# EAGLE board A20-Watermelon_Rev_A (EAGLE 4.16), part 1 of 6
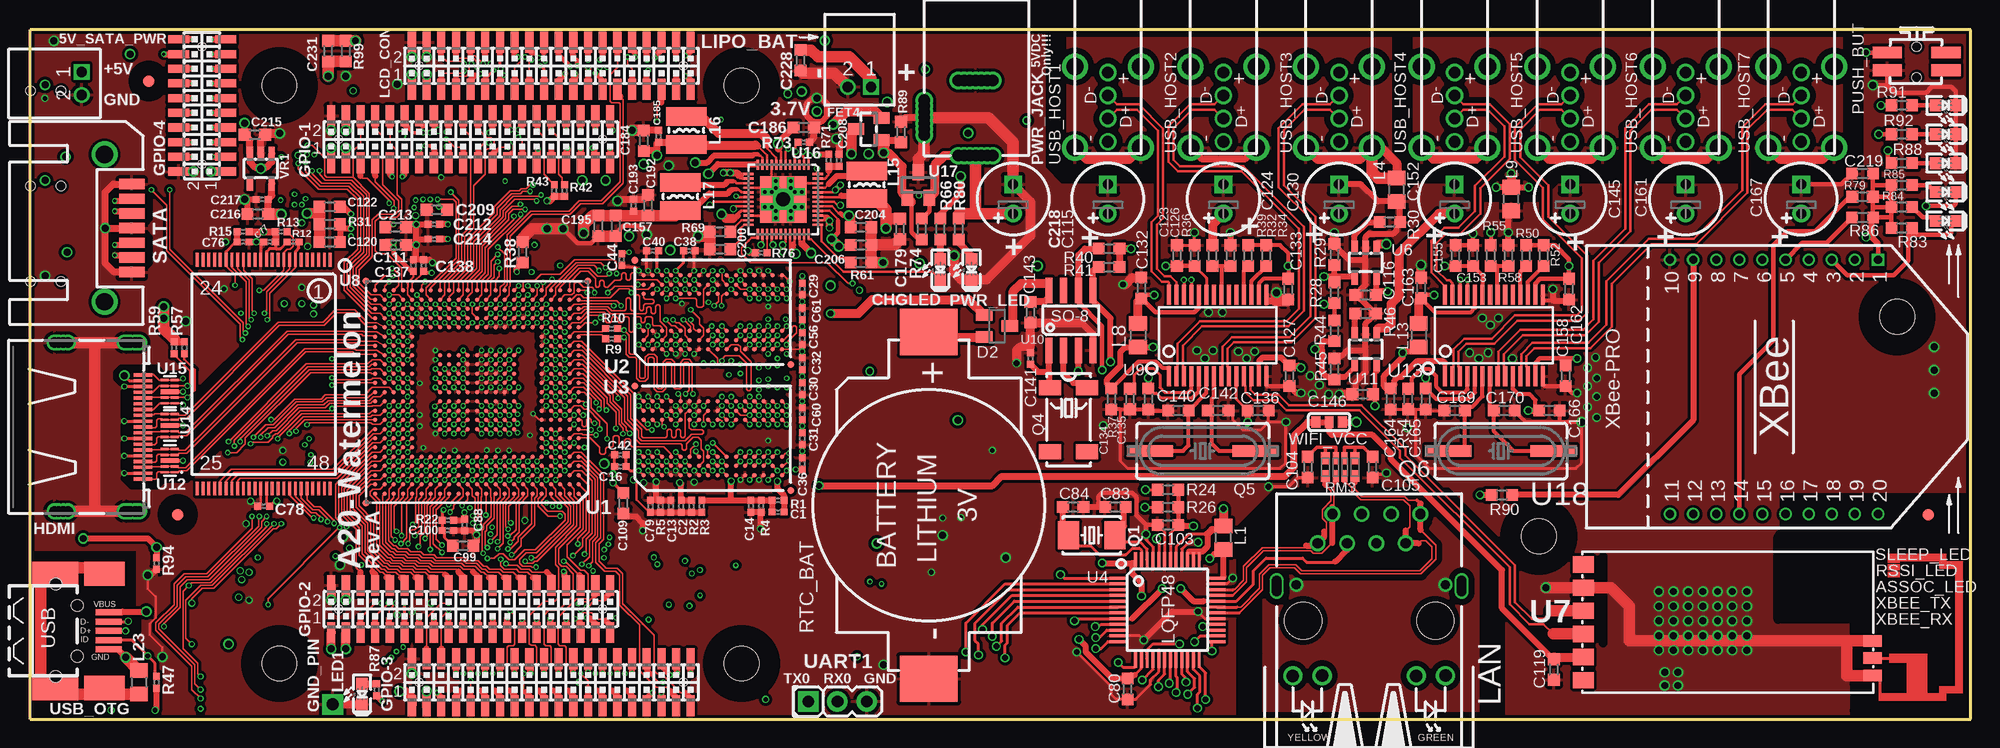
[diagram p5: board, top side]
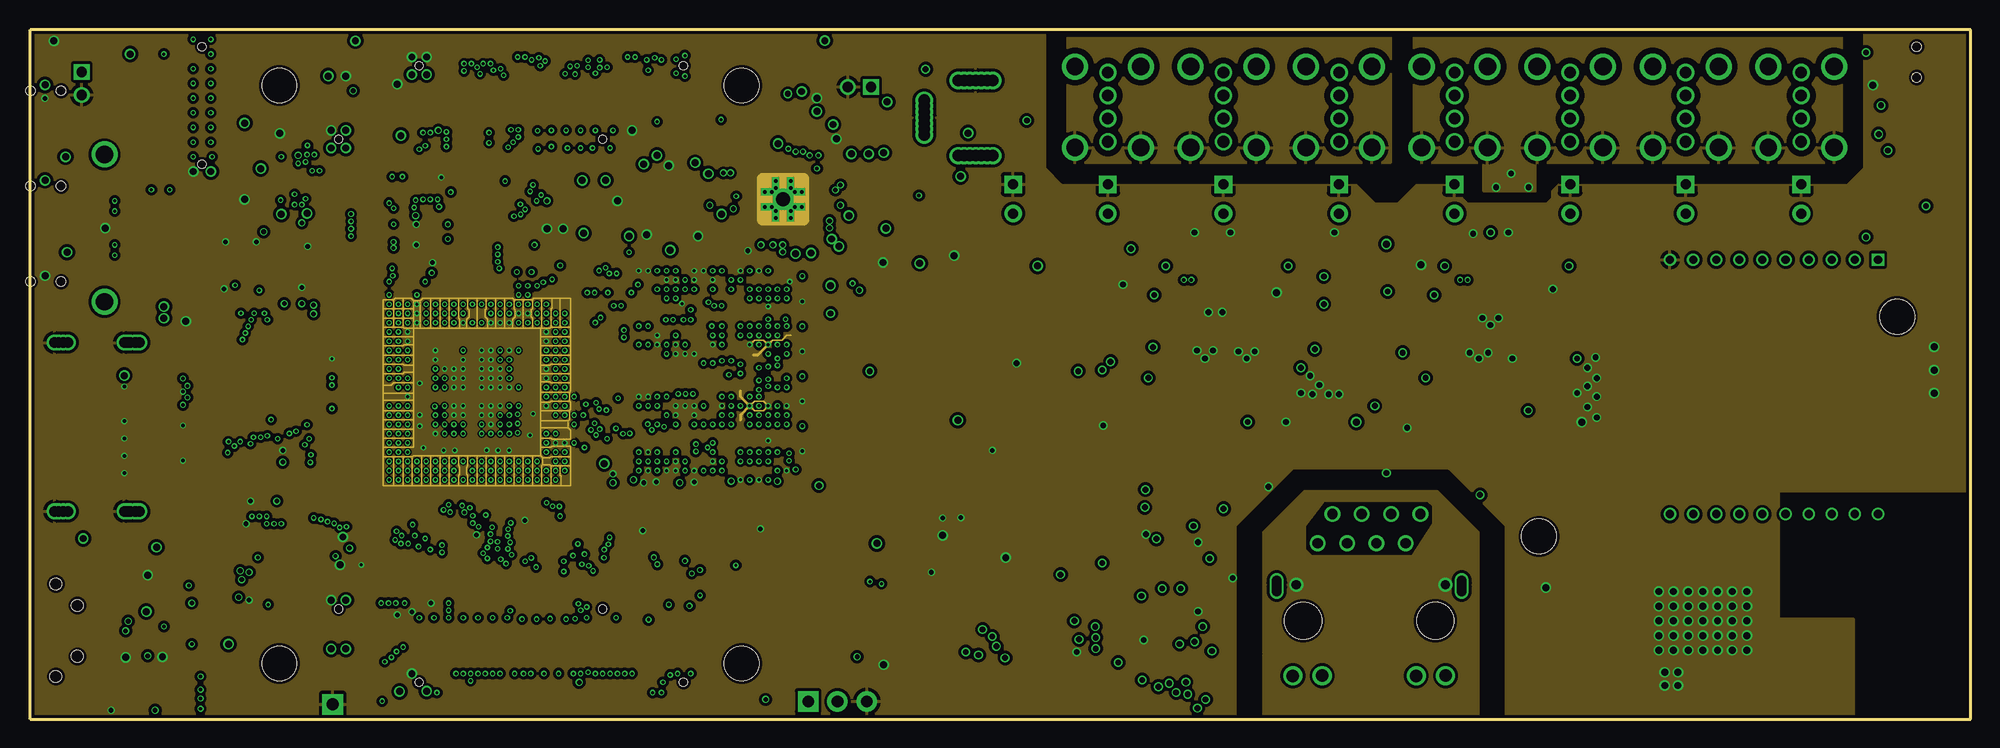
[diagram p6: board, inner layer GND]
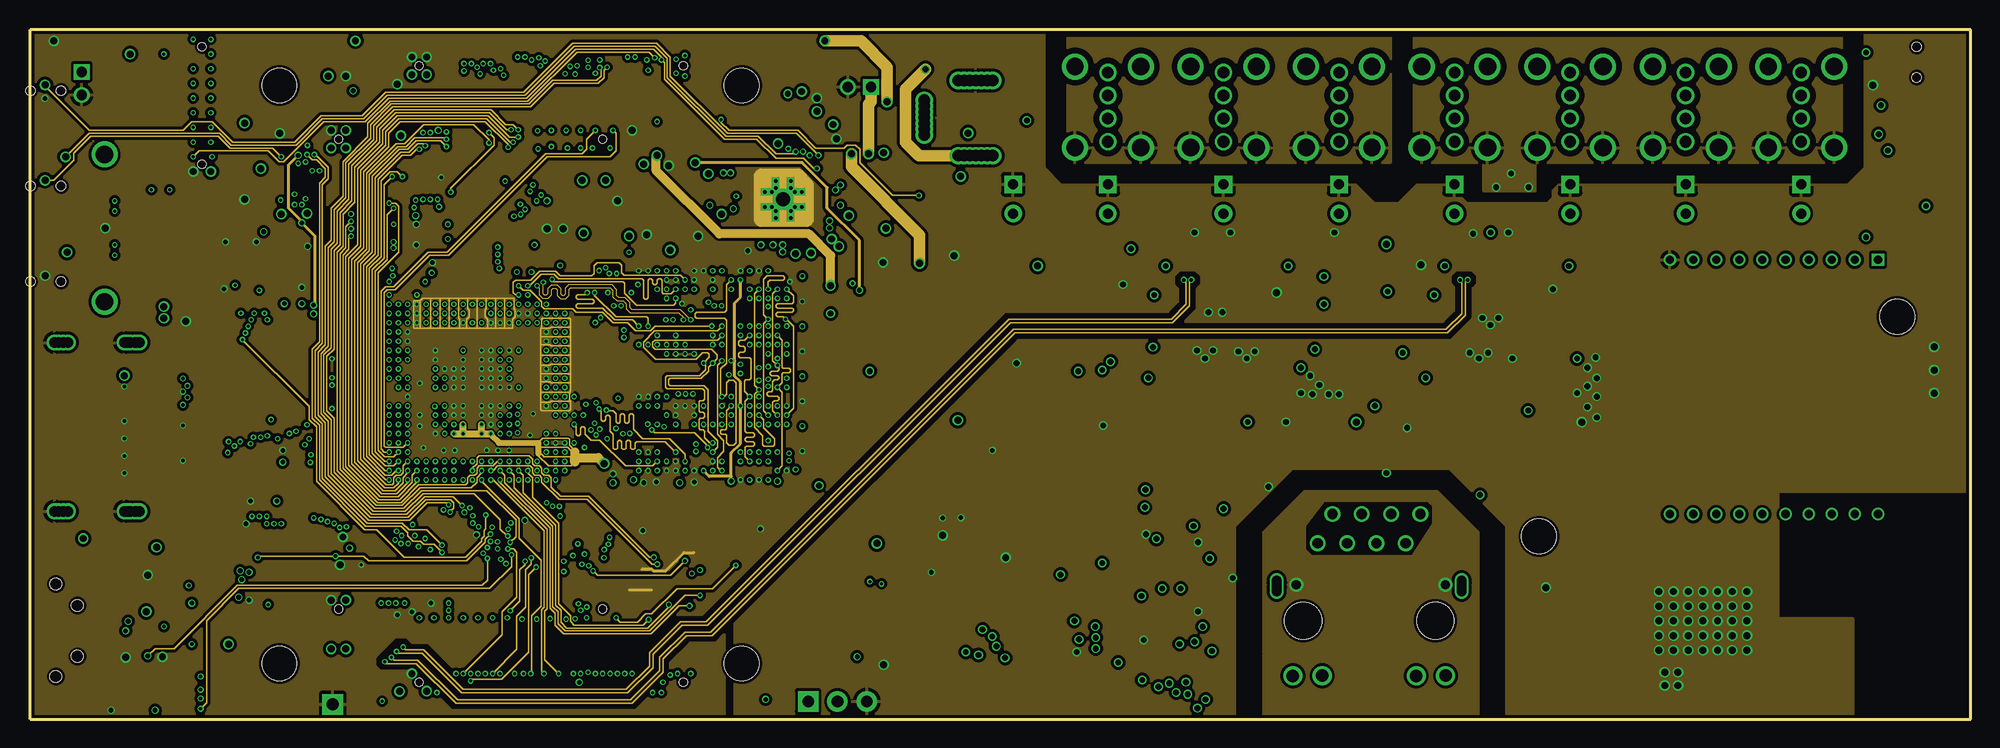
[diagram p7: board, inner layer Route3]
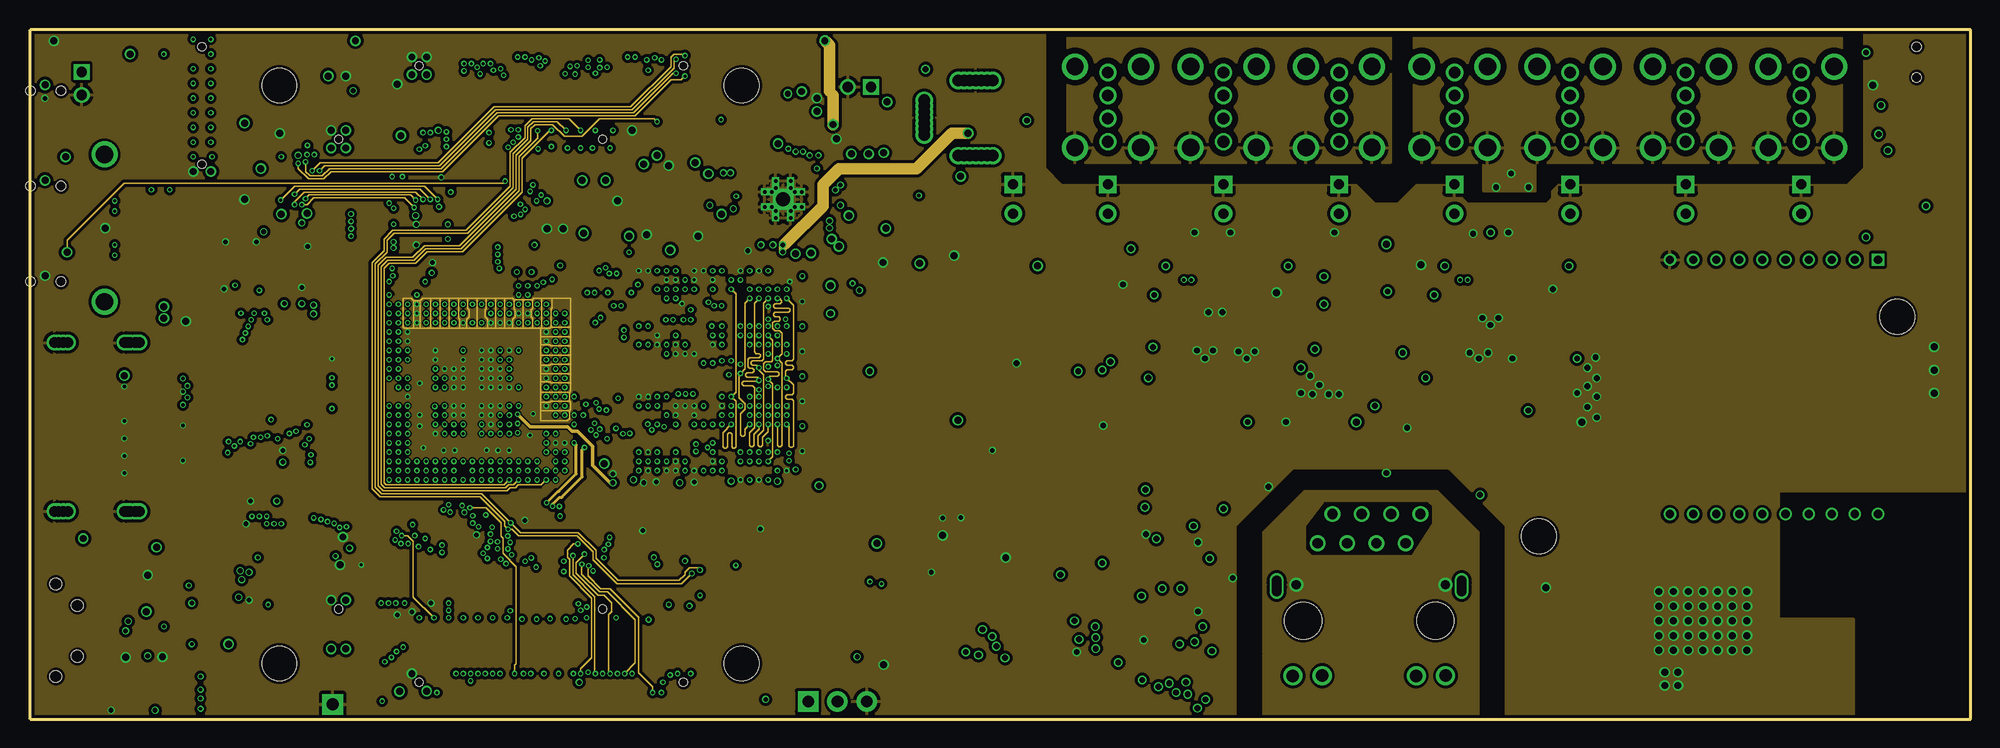
[diagram p8: board, inner layer Route4]
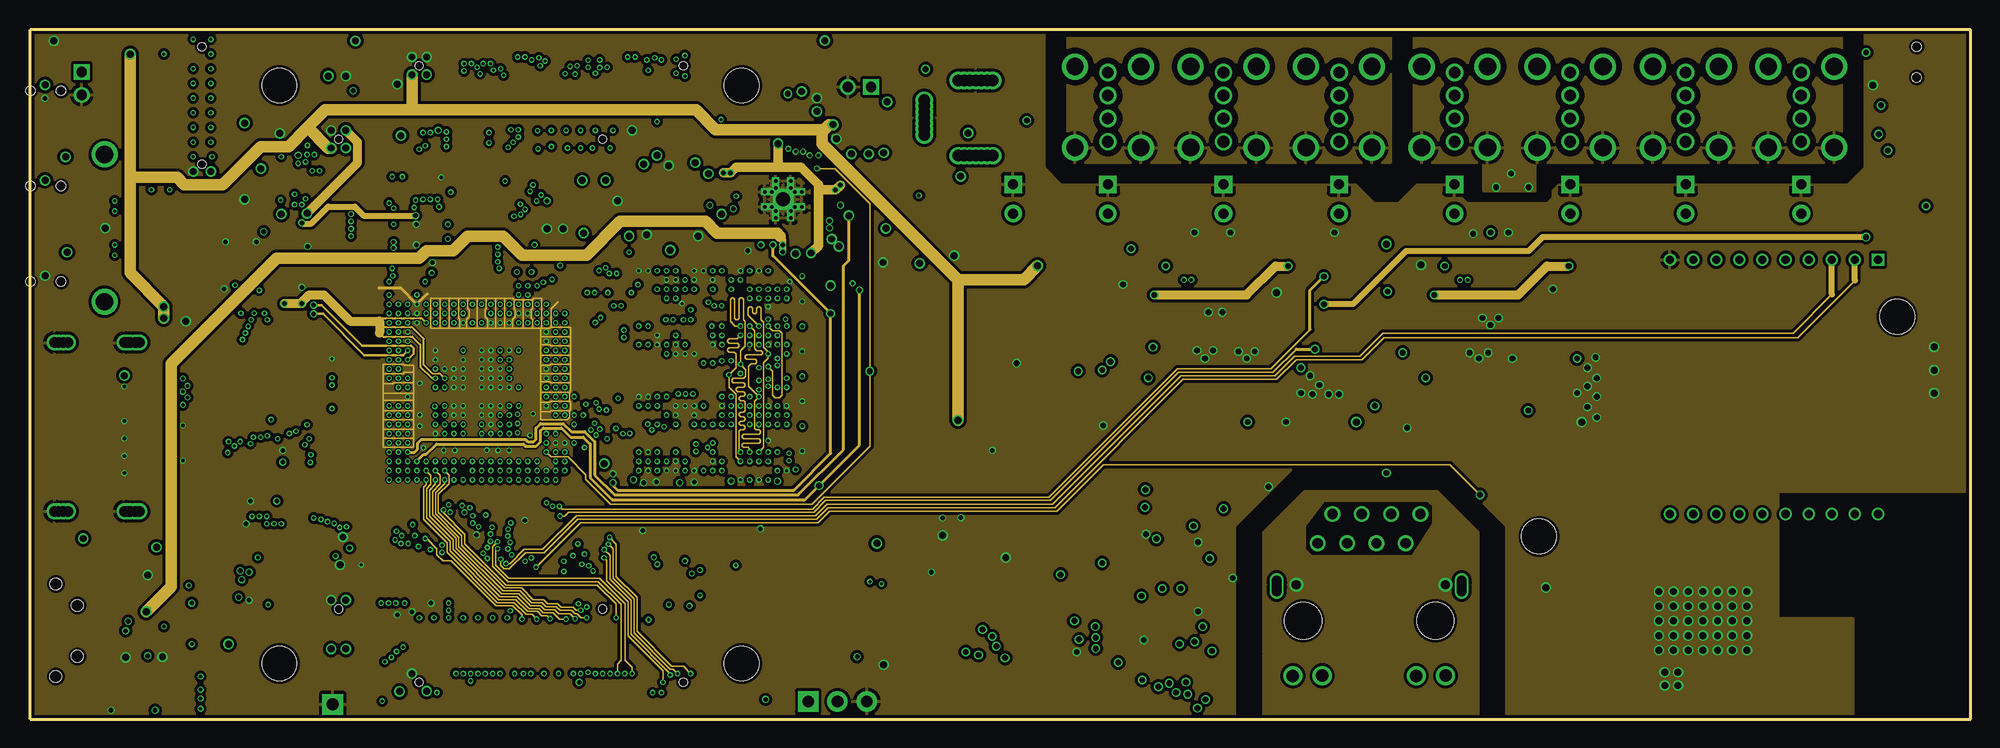
[diagram p9: board, inner layer Route13]
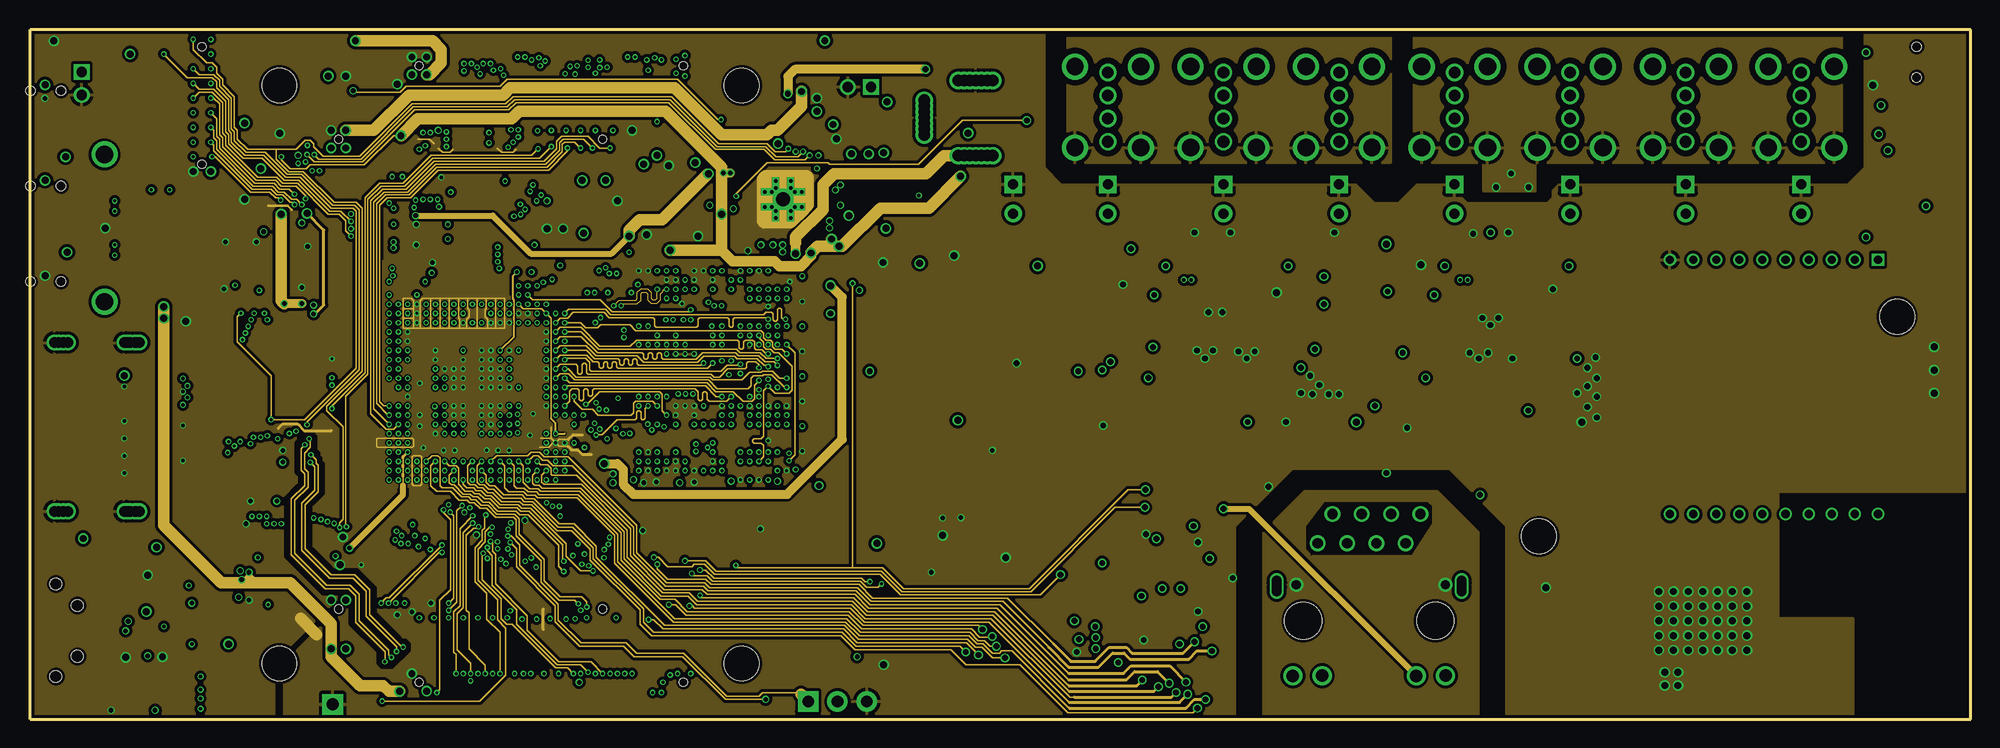
[diagram p10: board, inner layer Route14]
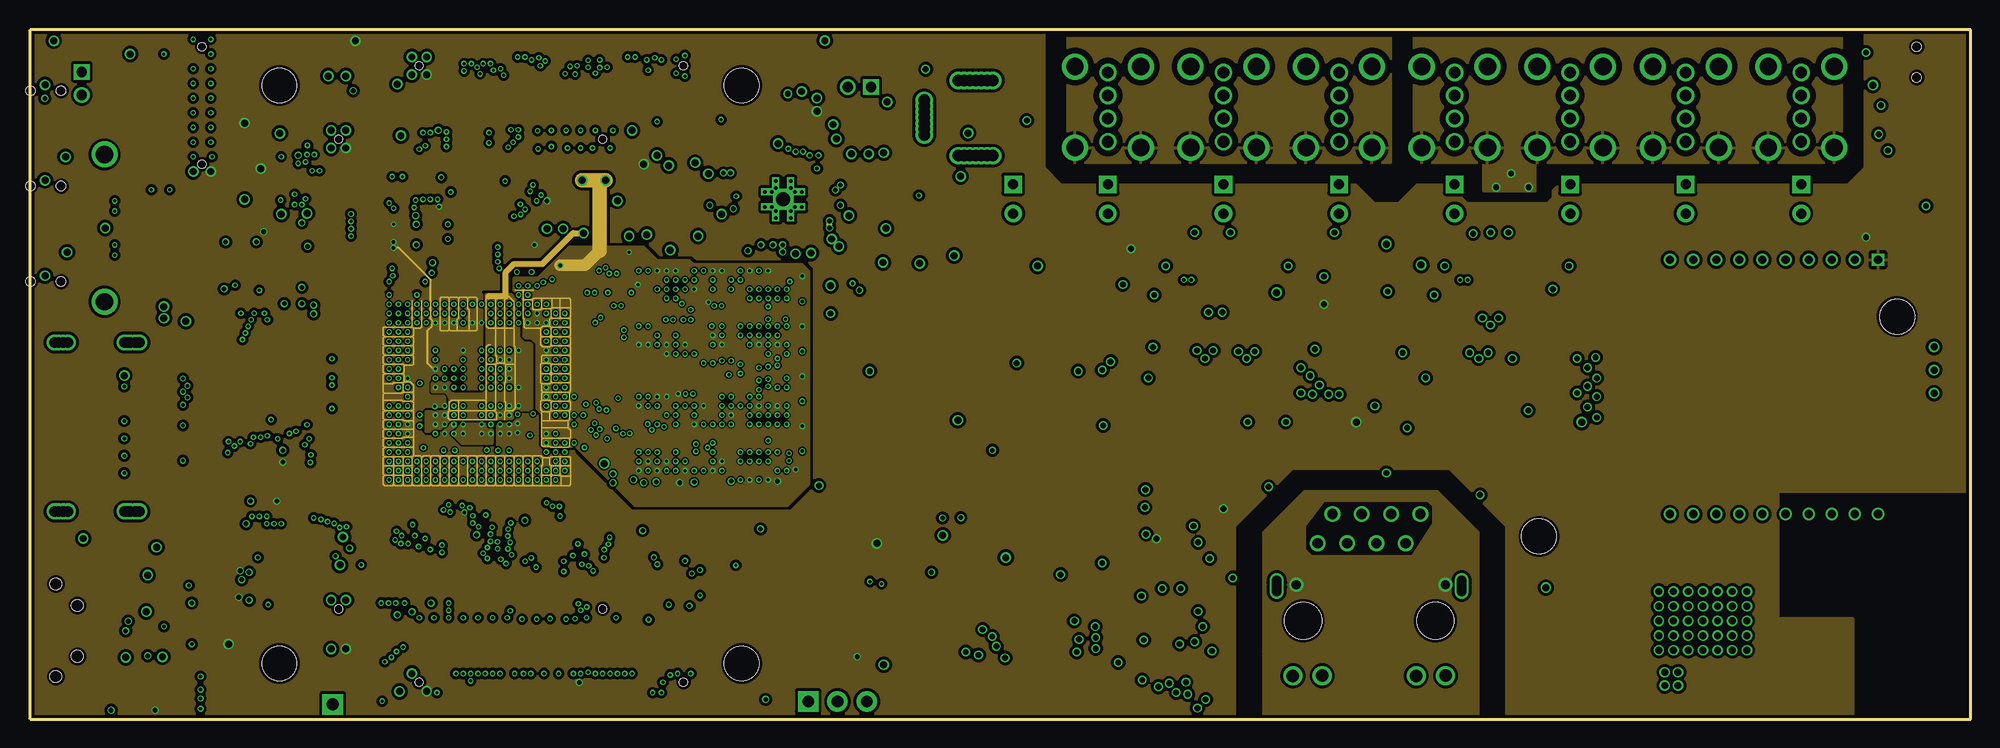
[diagram p11: board, inner layer PWR]
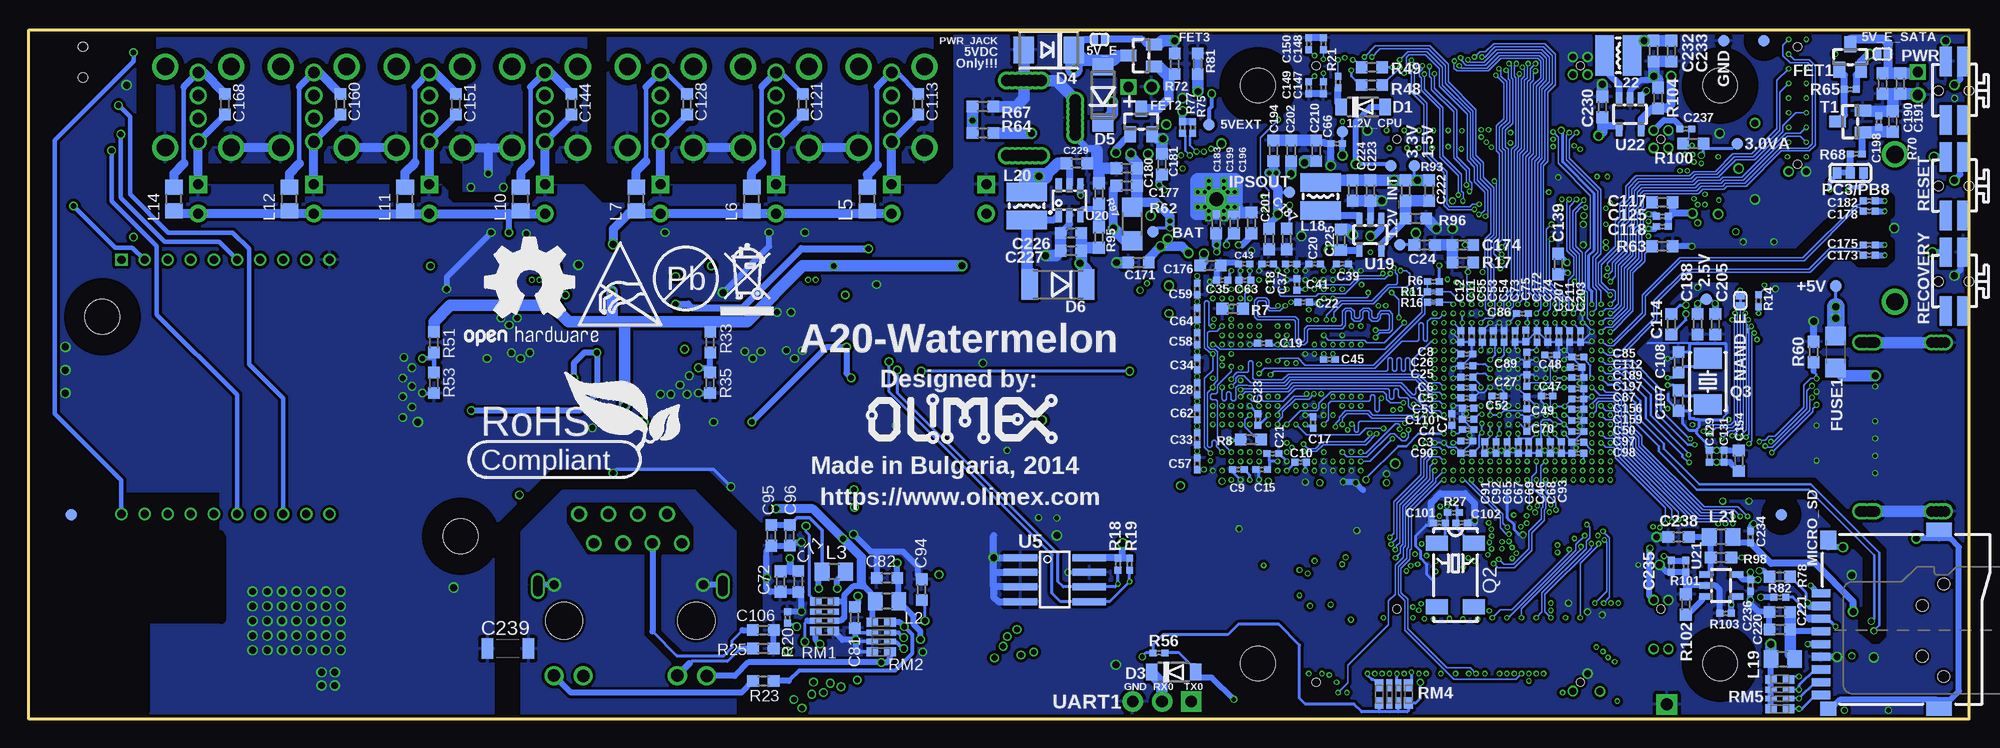
[diagram p12: board, bottom side, seen from below]

Size 167.91 x 59.61 mm. Coordinates in mm from the lower left corner, seen from the top.
Outline: 0,0 167.91,0 167.91,59.61 0,59.61 0,0
Copper layers (1+2*3+4*13+14*15+16): Top 0.035mm / dielectric 0.127mm / GND 0.035mm / dielectric 0.2mm / Route3 0.035mm / dielectric 0.187mm / Route4 0.035mm / dielectric 0.2mm / Route13 0.035mm / dielectric 0.187mm / Route14 0.035mm / dielectric 0.2mm / PWR 0.035mm / dielectric 0.127mm / Bottom 0.035mm
Design rules "default": minimum track width 4.5mil, minimum drill 10mil, track to track 5mil, track to pad 5mil, pad to pad 5mil, via to via 5mil, smd to smd 1mil, copper to edge 10mil, drill to drill 8mil, minimum pad ring 6mil, minimum via ring 4mil, stop-mask expansion 4mil, vias tented up to drill 25mil, thermal gap 12mil
Net classes: 2 90_MS: width 0.2 mm, drill 0.25 mm; 3 90_SL: width 0.127 mm, drill 0.178 mm; 4 MORE_CLEARANCE: drill 0.254 mm
Holes 3 mm at 21.55,54.81 61.55,54.81 21.55,4.81 61.55,4.81 130.55,15.81 161.55,34.81
tRestrict: area 18.5,51.8 to 24.5,57.8; area 58.5,51.8 to 64.5,57.8; area 58.5,1.8 to 64.5,7.8; area 18.5,1.8 to 24.5,7.8; area 127.6,12.8 to 133.6,18.8; area 158.6,31.8 to 164.6,37.8; 155 lines
bRestrict: area 18.5,51.8 to 24.5,57.8; area 58.5,51.8 to 64.5,57.8; area 58.5,1.8 to 64.5,7.8; area 18.5,1.8 to 24.5,7.8; area 127.6,12.8 to 133.6,18.8; area 158.6,31.8 to 164.6,37.8; 57 lines

## Footprints (pad centres in the part's own frame; a part is rotated, then mirrored left to right if it is on the bottom)
TESTPAD_40-ROUND = smd 1.016 x 1.016: 1 0,0
SJ_1_SMALLER = smd 0.508 x 0.762: 1 -0.381,0; 2 0.381,0
DW02R = drill 0.9 square: 1 -1,0 | drill 0.9 round: 2 1,0
LED-0603 = smd 1.016 x 1.016: A 0.889,0; C -0.889,0
C0402_TI = smd 0.61 x 0.584: 1 -0.508,0; 2 0.508,0
C0603_DWS = smd 1.016 x 1.016: 1 -0.889,0; 2 0.889,0
C0603_MM = smd 1 x 1: 1 -0.9,0; 2 0.9,0
E2,5-6,3 = drill 0.864 pad 1.524 round: + -1.27,0 | drill 0.864 pad 1.524 square: - 1.27,0
C1206_5MILS_WS_ISO = smd 1.016 x 1.778: 1 -1.778,0; 2 1.778,0
SOD-123 = smd 1 x 1.4: A 1.9,0; C -1.9,0
SOT23C = smd 1 x 1.4: 1 -0.95,-1.1; 2 0.95,-1.1; 3 0,1.1
DO214AA = smd 1.778 x 2.286: A 2.177,0; C -2.177,0
MLL-41 = smd 1.45 x 1.8: A 2.445,0; K -2.445,0
MELF-MLL41 = smd 1.45 x 2.6: 1 -2.445,0; 2 2.445,0
SOT23 = smd 1.4 x 1: 1 1.1,-0.95; 2 1.1,0.95; 3 -1.1,0
1206 = smd 1.6 x 1.8: 1 -1.4,0; 2 1.4,0
TEST_PAD40/70/SQUARE = drill 1.016 pad 1.778 square: P$1 0,0
GPH127SMT-02X20(PA-V16X-2X20-LF) = smd 0.7 x 1.8: 1 -12.065,-2.032; 2 -12.065,2.032; 3 -10.795,-2.032; 4 -10.795,2.032; 5 -9.525,-2.032; 6 -9.525,2.032; 7 -8.255,-2.032; 8 -8.255,2.032; 9 -6.985,-2.032; 10 -6.985,2.032; 11 -5.715,-2.032; 12 -5.715,2.032; 13 -4.445,-2.032; 14 -4.445,2.032; 15 -3.175,-2.032; 16 -3.175,2.032; 17 -1.905,-2.032; 18 -1.905,2.032; 19 -0.635,-2.032; 20 -0.635,2.032; 21 0.635,-2.032; 22 0.635,2.032; 23 1.905,-2.032; 24 1.905,2.032; 25 3.175,-2.032; 26 3.175,2.032; 27 4.445,-2.032; 28 4.445,2.032; 29 5.715,-2.032; 30 5.715,2.032; 31 6.985,-2.032; 32 6.985,2.032; 33 8.255,-2.032; 34 8.255,2.032; 35 9.525,-2.032; 36 9.525,2.032; 37 10.795,-2.032; 38 10.795,2.032; 39 12.065,-2.032; 40 12.065,2.032 | hole 0.7: -11.43,0; 11.43,0
GPH127SMT-02X10(PA-V16X-2X10-LF) = smd 0.7 x 1.8: 1 -5.715,-2.032; 2 -5.715,2.032; 3 -4.445,-2.032; 4 -4.445,2.032; 5 -3.175,-2.032; 6 -3.175,2.032; 7 -1.905,-2.032; 8 -1.905,2.032; 9 -0.635,-2.032; 10 -0.635,2.032; 11 0.635,-2.032; 12 0.635,2.032; 13 1.905,-2.032; 14 1.905,2.032; 15 3.175,-2.032; 16 3.175,2.032; 17 4.445,-2.032; 18 4.445,2.032; 19 5.715,-2.032; 20 5.715,2.032 | hole 0.7: -5.08,0; 5.08,0
HDMI-SWM-19 = smd 0.28 x 1.6: 1 -4.5,-5.55; 2 -4,-5.55; 3 -3.5,-5.55; 4 -3,-5.55; 5 -2.5,-5.55; 6 -2,-5.55; 7 -1.5,-5.55; 8 -1,-5.55; 9 -0.5,-5.55; 10 0,-5.55; 11 0.5,-5.55; 12 1,-5.55; 13 1.5,-5.55; 14 2,-5.55; 15 2.5,-5.55; 16 3,-5.55; 17 3.5,-5.55; 18 4,-5.55; 19 4.5,-5.55 | drill 0.9 round: P$5 -7.3,-4.85; P$7 -7.3,1.35; P$9 7.3,1.35; P$11 7.3,-4.85; P$13 -7.3,-4.45; P$15 -7.3,1.75; P$18 7.3,1.75; P$20 7.3,-4.45; P$21 -7.3,-4.15; P$22 -7.3,-4.95; P$23 7.3,-4.95; P$24 7.3,-4.15; P$25 -7.3,-5.25; P$26 7.3,-5.25; P$27 7.3,0.95; P$28 -7.3,0.95; SH1 -7.3,-3.95; SH2 -7.3,2.1; SH3 7.3,2.1; SH4 7.3,-3.95
L0805_5MIL_DWS = smd 1.27 x 1.524: 1 -1.016,0; 2 1.016,0
CD32 = smd 1.6 x 3.5: 1 -1.2,0; 2 1.2,0
RJLBC-060TC1_MILLING = drill 0.9 round: 1 -4.455,6.7; 2 -3.185,9.24; 3 -1.915,6.7; 4 -0.645,9.24; 5 0.625,6.7; 6 1.895,9.24; 7 3.165,6.7; 8 4.435,9.24 | drill 0.8 round: _1 -8,2.5; _2 -8,2.7; _3 -8,2.9; _4 -8,3.3; _5 -8,3.5; _6 8,3.5; _7 8,3.3; _8 8,2.9; _9 8,2.7; _10 8,2.5; GND1 -8,3.1; GND2 8,3.1 | drill 1.1 round: AG 4.07,-4.773; AY -6.61,-4.773; KG 6.61,-4.748; KY -4.07,-4.748 | hole 3.2: -5.715,0; 5.715,0
TFC-WPAPR-08 = smd 1.6 x 0.7: 1 -7.375,2.25; 2 -7.375,1.15; 3 -7.375,0.05; 4 -7.375,-1.05; 5 -7.375,-2.15; 6 -7.375,-3.25; 7 -7.375,-4.35; 8 -7.375,-5.45; 9 -7.375,-6.55 | smd 1.4 x 1.2: 10 -6.75,-7.75 | smd 1.4 x 1.6: 11 -6.75,6.85 | smd 2.2 x 1.2: 12 2.85,-7.75; 13 2.85,7.75 | hole 1: 3.25,-4.95; 3.25,3.05
SJ_1_SMALLER_CLOSE_10MILS = smd 0.508 x 0.762: 1 -0.381,0; 2 0.381,0
SJ_2_SMALL_23_TIED = smd 0.762 x 1.016: 1 -1.143,0; 2 0,0; 3 1.143,0
SW_TAKT3X4 = smd 2.54 x 1.016: 1_1 -2.54,0.762; 1_2 2.54,0.762; 2_1 -2.54,-0.762; 2_2 2.54,-0.762 | hole 0.8: 0,-1.397; 0,1.27
PWR_JACK_UNI_MILLING = drill 1 round: + 0,4.75; +1 0,5.25; +2 0,5.75; +3 0,6.25; +4 0,4.25; +5 0,3.75; +6 0,3.25; - -6.5,4.75; -1 -6.5,5.25; -2 -6.5,5.75; -3 -6.5,4.25; -4 -6.5,3.75; -5 -6.5,6.25; -6 -6.5,3.25; -- -3.3,0.3; --1 -3.8,0.3; --2 -4.3,0.3; --3 -4.8,0.3; --4 -2.8,0.3; --5 -2.3,0.3; --6 -1.8,0.3
HCX-4S = smd 1.8 x 2.4: 1 -2,0; 2 2,0
MC-306 = smd 1.3 x 1.9: 1 -2.75,-1.6; 2 2.75,-1.6; 3 2.75,1.6; 4 -2.75,1.6
HC49/SMD2_THIN&SHORT = smd 4 x 1: 1 -4.564,0; 2 4.564,0
R0402_TI = smd 0.61 x 0.584: 1 -0.508,0; 2 0.508,0
R0603_5MIL_DWS = smd 1.016 x 1.016: 1 -0.889,0; 2 0.889,0
R0402_TI_0R = smd 0.61 x 0.584: 1 -0.508,0; 2 0.508,0
R0603MM = smd 1 x 1: 1 -0.9,0; 2 0.9,0
R1206_5MIL_WS = smd 1.651 x 1.778: 1 -1.46,0; 2 1.46,0
0603_0R = smd 1.016 x 1.016: 1 -0.889,0; 2 0.889,0
R_MATRIX_4 = smd 0.762 x 1.016: 1.1 -1.27,-0.762; 1.2 -1.27,0.762; 4.1 1.27,-0.762; 4.2 1.27,0.762 | smd 0.508 x 1.016: 2.1 -0.381,-0.762; 2.2 -0.381,0.762; 3.1 0.381,-0.762; 3.2 0.381,0.762
3V_BAT_HOLDER = smd 2 x 2: 1+ -15,0 | smd 4 x 5: + -15,0; - 15,0
SATA-PWA-07 = smd 0.9 x 2.2: 1 -4.25,-4.8; 2 -2.98,-4.8; 3 -1.71,-4.8; 4 -0.44,-4.8; 5 0.83,-4.8; 6 2.1,-4.8; 7 3.37,-4.8 | drill 1.5 round: P$8 -6.81,-2.44; P$9 5.93,-2.44
TFBGA441 = smd 0.4 x 0.4: A1 -8.8,8.8; A2 -8,8.8; A3 -7.2,8.8; A4 -6.4,8.8; A5 -5.6,8.8; A6 -4.8,8.8; A7 -4,8.8; A8 -3.2,8.8; A9 -2.4,8.8; A10 -1.6,8.8; A11 -0.8,8.8; A12 0,8.8; A13 0.8,8.8; A14 1.6,8.8; A15 2.4,8.8; A16 3.2,8.8; A17 4,8.8; A18 4.8,8.8; A19 5.6,8.8; A20 6.4,8.8; A21 7.2,8.8; A22 8,8.8; A23 8.8,8.8; AA1 -8.8,-7.2; AA2 -8,-7.2; AA3 -7.2,-7.2; AA4 -6.4,-7.2; AA5 -5.6,-7.2; AA6 -4.8,-7.2; AA7 -4,-7.2; AA8 -3.2,-7.2; AA9 -2.4,-7.2; AA10 -1.6,-7.2; AA11 -0.8,-7.2; AA12 0,-7.2; AA13 0.8,-7.2; AA14 1.6,-7.2; AA15 2.4,-7.2; AA16 3.2,-7.2; AA17 4,-7.2; AA18 4.8,-7.2; AA19 5.6,-7.2; AA20 6.4,-7.2; AA21 7.2,-7.2; AA22 8,-7.2; AA23 8.8,-7.2; AB1 -8.8,-8; AB2 -8,-8; AB3 -7.2,-8; AB4 -6.4,-8; AB5 -5.6,-8; AB6 -4.8,-8; AB7 -4,-8; AB8 -3.2,-8; AB9 -2.4,-8; AB10 -1.6,-8; AB11 -0.8,-8; AB12 0,-8; AB13 0.8,-8; AB14 1.6,-8; AB15 2.4,-8; AB16 3.2,-8; AB17 4,-8; AB18 4.8,-8; AB19 5.6,-8; AB20 6.4,-8; AB21 7.2,-8; AB22 8,-8; AB23 8.8,-8; AC1 -8.8,-8.8; AC2 -8,-8.8; AC3 -7.2,-8.8; AC4 -6.4,-8.8; AC5 -5.6,-8.8; AC6 -4.8,-8.8; AC7 -4,-8.8; AC8 -3.2,-8.8; AC9 -2.4,-8.8; AC10 -1.6,-8.8; AC11 -0.8,-8.8; AC12 0,-8.8; AC13 0.8,-8.8; AC14 1.6,-8.8; AC15 2.4,-8.8; AC16 3.2,-8.8; AC17 4,-8.8; AC18 4.8,-8.8; AC19 5.6,-8.8; AC20 6.4,-8.8; AC21 7.2,-8.8; AC22 8,-8.8; AC23 8.8,-8.8; B1 -8.8,8; B2 -8,8; B3 -7.2,8; B4 -6.4,8; B5 -5.6,8; B6 -4.8,8; B7 -4,8; B8 -3.2,8; B9 -2.4,8; B10 -1.6,8; B11 -0.8,8; B12 0,8; B13 0.8,8; B14 1.6,8; B15 2.4,8; B16 3.2,8; B17 4,8; B18 4.8,8; B19 5.6,8; B20 6.4,8; B21 7.2,8; B22 8,8; B23 8.8,8; C1 -8.8,7.2; C2 -8,7.2; C3 -7.2,7.2; C4 -6.4,7.2; C5 -5.6,7.2; C6 -4.8,7.2; C7 -4,7.2; C8 -3.2,7.2; C9 -2.4,7.2; C10 -1.6,7.2; C11 -0.8,7.2; C12 0,7.2; C13 0.8,7.2; C14 1.6,7.2; C15 2.4,7.2; C16 3.2,7.2; C17 4,7.2; C18 4.8,7.2; C19 5.6,7.2; C20 6.4,7.2; C21 7.2,7.2; C22 8,7.2; C23 8.8,7.2; D1 -8.8,6.4; D2 -8,6.4; D3 -7.2,6.4; D4 -6.4,6.4; D5 -5.6,6.4; D6 -4.8,6.4; D7 -4,6.4; D8 -3.2,6.4; D9 -2.4,6.4; D10 -1.6,6.4; D11 -0.8,6.4; D12 0,6.4; D13 0.8,6.4; D14 1.6,6.4; D15 2.4,6.4; D16 3.2,6.4; D17 4,6.4; D18 4.8,6.4; D19 5.6,6.4; D20 6.4,6.4; D21 7.2,6.4; D22 8,6.4; D23 8.8,6.4; E1 -8.8,5.6; E2 -8,5.6; E3 -7.2,5.6; E4 -6.4,5.6; E5 -5.6,5.6; E6 -4.8,5.6; E7 -4,5.6; E8 -3.2,5.6; E9 -2.4,5.6; E10 -1.6,5.6; E11 -0.8,5.6; E12 0,5.6; E13 0.8,5.6; E14 1.6,5.6; E15 2.4,5.6; E16 3.2,5.6; E17 4,5.6; E18 4.8,5.6; E19 5.6,5.6; E20 6.4,5.6; E21 7.2,5.6; E22 8,5.6; E23 8.8,5.6; F1 -8.8,4.8; F2 -8,4.8; F3 -7.2,4.8; F4 -6.4,4.8; F5 -5.6,4.8; F19 5.6,4.8; F20 6.4,4.8; F21 7.2,4.8; F22 8,4.8; F23 8.8,4.8; G1 -8.8,4; G2 -8,4; G3 -7.2,4; G4 -6.4,4; G5 -5.6,4; G19 5.6,4; G20 6.4,4; G21 7.2,4; G22 8,4; G23 8.8,4; H1 -8.8,3.2; H2 -8,3.2; H3 -7.2,3.2; H4 -6.4,3.2; H5 -5.6,3.2; H8 -3.2,3.2; H9 -2.4,3.2; H10 -1.6,3.2; H11 -0.8,3.2; H12 0,3.2; H13 0.8,3.2; H14 1.6,3.2; H15 2.4,3.2; H16 3.2,3.2; H19 5.6,3.2; H20 6.4,3.2; H21 7.2,3.2; H22 8,3.2; H23 8.8,3.2; J1 -8.8,2.4; J2 -8,2.4; J3 -7.2,2.4; J4 -6.4,2.4; J5 -5.6,2.4; J8 -3.2,2.4; J9 -2.4,2.4; J10 -1.6,2.4; J11 -0.8,2.4; J12 0,2.4; J13 0.8,2.4; J14 1.6,2.4; J15 2.4,2.4; J16 3.2,2.4; J19 5.6,2.4; J20 6.4,2.4; J21 7.2,2.4; J22 8,2.4; J23 8.8,2.4; K1 -8.8,1.6; K2 -8,1.6; K3 -7.2,1.6; K4 -6.4,1.6; K5 -5.6,1.6; K8 -3.2,1.6; K9 -2.4,1.6; K10 -1.6,1.6; K11 -0.8,1.6; K12 0,1.6; K13 0.8,1.6; K14 1.6,1.6; K15 2.4,1.6; K16 3.2,1.6; K19 5.6,1.6; K20 6.4,1.6; K21 7.2,1.6; K22 8,1.6; K23 8.8,1.6; L1 -8.8,0.8; L2 -8,0.8; L3 -7.2,0.8; L4 -6.4,0.8; L5 -5.6,0.8; L8 -3.2,0.8; L9 -2.4,0.8; L10 -1.6,0.8; L11 -0.8,0.8; L12 0,0.8; L13 0.8,0.8; L14 1.6,0.8; L15 2.4,0.8; L16 3.2,0.8; L19 5.6,0.8; L20 6.4,0.8; L21 7.2,0.8; L22 8,0.8; L23 8.8,0.8; M1 -8.8,0; M2 -8,0; M3 -7.2,0; M4 -6.4,0; M5 -5.6,0; M8 -3.2,0; M9 -2.4,0; M10 -1.6,0; M11 -0.8,0; M12 0,0; M13 0.8,0; M14 1.6,0; M15 2.4,0; M16 3.2,0; M19 5.6,0; M20 6.4,0; M21 7.2,0; M22 8,0; M23 8.8,0; N1 -8.8,-0.8; N2 -8,-0.8; N3 -7.2,-0.8; N4 -6.4,-0.8; N5 -5.6,-0.8; N8 -3.2,-0.8; N9 -2.4,-0.8; N10 -1.6,-0.8; N11 -0.8,-0.8; N12 0,-0.8; N13 0.8,-0.8; N14 1.6,-0.8; N15 2.4,-0.8; N16 3.2,-0.8; N19 5.6,-0.8; N20 6.4,-0.8; N21 7.2,-0.8; N22 8,-0.8; N23 8.8,-0.8; P1 -8.8,-1.6; P2 -8,-1.6; P3 -7.2,-1.6; P4 -6.4,-1.6; P5 -5.6,-1.6; P8 -3.2,-1.6; P9 -2.4,-1.6; P10 -1.6,-1.6; P11 -0.8,-1.6; P12 0,-1.6; P13 0.8,-1.6; P14 1.6,-1.6; P15 2.4,-1.6; P16 3.2,-1.6; P19 5.6,-1.6; P20 6.4,-1.6; P21 7.2,-1.6; P22 8,-1.6; P23 8.8,-1.6; R1 -8.8,-2.4; R2 -8,-2.4; R3 -7.2,-2.4; R4 -6.4,-2.4; R5 -5.6,-2.4; R8 -3.2,-2.4; R9 -2.4,-2.4; R10 -1.6,-2.4; R11 -0.8,-2.4; R12 0,-2.4; R13 0.8,-2.4; R14 1.6,-2.4; R15 2.4,-2.4; R16 3.2,-2.4; R19 5.6,-2.4; R20 6.4,-2.4; R21 7.2,-2.4; R22 8,-2.4; R23 8.8,-2.4; T1 -8.8,-3.2; T2 -8,-3.2; T3 -7.2,-3.2; T4 -6.4,-3.2; T5 -5.6,-3.2; T8 -3.2,-3.2; T9 -2.4,-3.2; T10 -1.6,-3.2; T11 -0.8,-3.2; T12 0,-3.2; T13 0.8,-3.2; T14 1.6,-3.2; T15 2.4,-3.2; T16 3.2,-3.2; T19 5.6,-3.2; T20 6.4,-3.2; T21 7.2,-3.2; T22 8,-3.2; T23 8.8,-3.2; U1 -8.8,-4; U2 -8,-4; U3 -7.2,-4; U4 -6.4,-4; U5 -5.6,-4; U19 5.6,-4; U20 6.4,-4; U21 7.2,-4; U22 8,-4; U23 8.8,-4; V1 -8.8,-4.8; V2 -8,-4.8; V3 -7.2,-4.8; V4 -6.4,-4.8; V5 -5.6,-4.8; V19 5.6,-4.8; V20 6.4,-4.8; V21 7.2,-4.8; V22 8,-4.8; V23 8.8,-4.8; W1 -8.8,-5.6; W2 -8,-5.6; W3 -7.2,-5.6; W4 -6.4,-5.6; W5 -5.6,-5.6; W6 -4.8,-5.6; W7 -4,-5.6; W8 -3.2,-5.6; W9 -2.4,-5.6; W10 -1.6,-5.6; W11 -0.8,-5.6; W12 0,-5.6; W13 0.8,-5.6; W14 1.6,-5.6; W15 2.4,-5.6; W16 3.2,-5.6; W17 4,-5.6; W18 4.8,-5.6; W19 5.6,-5.6; W20 6.4,-5.6; W21 7.2,-5.6; W22 8,-5.6; W23 8.8,-5.6; Y1 -8.8,-6.4; Y2 -8,-6.4; Y3 -7.2,-6.4; Y4 -6.4,-6.4; Y5 -5.6,-6.4; Y6 -4.8,-6.4; Y7 -4,-6.4; Y8 -3.2,-6.4; Y9 -2.4,-6.4; Y10 -1.6,-6.4; Y11 -0.8,-6.4; Y12 0,-6.4; Y13 0.8,-6.4; Y14 1.6,-6.4; Y15 2.4,-6.4; Y16 3.2,-6.4; Y17 4,-6.4; Y18 4.8,-6.4; Y19 5.6,-6.4; Y20 6.4,-6.4; Y21 7.2,-6.4; Y22 8,-6.4; Y23 8.8,-6.4 | smd 0.6 x 0.6: FID1 9.6,9.6; FID2 9.6,-9.6; FID3 -9.6,-9.6
FBGA96_MEM = smd 0.4 x 0.4: A1 -6,-3.2; A2 -6,-2.4; A3 -6,-1.6; A7 -6,1.6; A8 -6,2.4; A9 -6,3.2; B1 -5.2,-3.2; B2 -5.2,-2.4; B3 -5.2,-1.6; B7 -5.2,1.6; B8 -5.2,2.4; B9 -5.2,3.2; C1 -4.4,-3.2; C2 -4.4,-2.4; C3 -4.4,-1.6; C7 -4.4,1.6; C8 -4.4,2.4; C9 -4.4,3.2; D1 -3.6,-3.2; D2 -3.6,-2.4; D3 -3.6,-1.6; D7 -3.6,1.6; D8 -3.6,2.4; D9 -3.6,3.2; E1 -2.8,-3.2; E2 -2.8,-2.4; E3 -2.8,-1.6; E7 -2.8,1.6; E8 -2.8,2.4; E9 -2.8,3.2; F1 -2,-3.2; F2 -2,-2.4; F3 -2,-1.6; F7 -2,1.6; F8 -2,2.4; F9 -2,3.2; G1 -1.2,-3.2; G2 -1.2,-2.4; G3 -1.2,-1.6; G7 -1.2,1.6; G8 -1.2,2.4; G9 -1.2,3.2; H1 -0.4,-3.2; H2 -0.4,-2.4; H3 -0.4,-1.6; H7 -0.4,1.6; H8 -0.4,2.4; H9 -0.4,3.2; J1 0.4,-3.2; J2 0.4,-2.4; J3 0.4,-1.6; J7 0.4,1.6; J8 0.4,2.4; J9 0.4,3.2; K1 1.2,-3.2; K2 1.2,-2.4; K3 1.2,-1.6; K7 1.2,1.6; K8 1.2,2.4; K9 1.2,3.2; L1 2,-3.2; L2 2,-2.4; L3 2,-1.6; L7 2,1.6; L8 2,2.4; L9 2,3.2; M1 2.8,-3.2; M2 2.8,-2.4; M3 2.8,-1.6; M7 2.8,1.6; M8 2.8,2.4; M9 2.8,3.2; N1 3.6,-3.2; N2 3.6,-2.4; N3 3.6,-1.6; N7 3.6,1.6; N8 3.6,2.4; N9 3.6,3.2; P1 4.4,-3.2; P2 4.4,-2.4; P3 4.4,-1.6; P7 4.4,1.6; P8 4.4,2.4; P9 4.4,3.2; R1 5.2,-3.2; R2 5.2,-2.4; R3 5.2,-1.6; R7 5.2,1.6; R8 5.2,2.4; R9 5.2,3.2; T1 6,-3.2; T2 6,-2.4; T3 6,-1.6; T7 6,1.6; T8 6,2.4; T9 6,3.2 | smd 0.6 x 0.6: FID1 6.75,-4.5; FID2 -6.75,4.5
LQFP48 = smd 0.254 x 1.4: 1 -2.75,-4.3; 2 -2.25,-4.3; 3 -1.75,-4.3; 4 -1.25,-4.3; 5 -0.75,-4.3; 6 -0.25,-4.3; 7 0.25,-4.3; 8 0.75,-4.3; 9 1.25,-4.3; 10 1.75,-4.3; 11 2.25,-4.3; 12 2.75,-4.3; 25 2.75,4.3; 26 2.25,4.3; 27 1.75,4.3; 28 1.25,4.3; 29 0.75,4.3; 30 0.25,4.3; 31 -0.25,4.3; 32 -0.75,4.3; 33 -1.25,4.3; 34 -1.75,4.3; 35 -2.25,4.3; 36 -2.75,4.3 | smd 1.4 x 0.254: 13 4.3,-2.75; 14 4.3,-2.25; 15 4.3,-1.75; 16 4.3,-1.25; 17 4.3,-0.75; 18 4.3,-0.25; 19 4.3,0.25; 20 4.3,0.75; 21 4.3,1.25; 22 4.3,1.75; 23 4.3,2.25; 24 4.3,2.75; 37 -4.3,2.75; 38 -4.3,2.25; 39 -4.3,1.75; 40 -4.3,1.25; 41 -4.3,0.75; 42 -4.3,0.25; 43 -4.3,-0.25; 44 -4.3,-0.75; 45 -4.3,-1.25; 46 -4.3,-1.75; 47 -4.3,-2.25; 48 -4.3,-2.75
SO-08MN = smd 0.61 x 2.921: 1 -1.905,-2.981; 2 -0.635,-2.981; 3 0.635,-2.981; 4 1.905,-2.981; 5 1.905,2.981; 6 0.635,2.981; 7 -0.635,2.981; 8 -1.905,2.981
SOT23-5 = smd 1.2 x 0.55: 1 1.3,-0.95; 2 1.3,0; 3 1.3,0.95; 4 -1.3,0.95; 5 -1.3,-0.95
PCB_WIFI = smd 1.8 x 1.4: 1 12.5,-5; 2 12.5,-3; 3 12.5,-1; 4 12.5,1; 5 12.5,3; 6 12.5,5 | smd 1.6 x 1: 7 -12.5,4.6; 8 -12.5,3.1; 9 -12.5,1.6
TSOP48 = smd 1.2 x 0.25: 1 -9.9,5.75; 2 -9.9,5.25; 3 -9.9,4.75; 4 -9.9,4.25; 5 -9.9,3.75; 6 -9.9,3.25; 7 -9.9,2.75; 8 -9.9,2.25; 9 -9.9,1.75; 10 -9.9,1.25; 11 -9.9,0.75; 12 -9.9,0.25; 13 -9.9,-0.25; 14 -9.9,-0.75; 15 -9.9,-1.25; 16 -9.9,-1.75; 17 -9.9,-2.25; 18 -9.9,-2.75; 19 -9.9,-3.25; 20 -9.9,-3.75; 21 -9.9,-4.25; 22 -9.9,-4.75; 23 -9.9,-5.25; 24 -9.9,-5.75; 25 9.9,-5.75; 26 9.9,-5.25; 27 9.9,-4.75; 28 9.9,-4.25; 29 9.9,-3.75; 30 9.9,-3.25; 31 9.9,-2.75; 32 9.9,-2.25; 33 9.9,-1.75; 34 9.9,-1.25; 35 9.9,-0.75; 36 9.9,-0.25; 37 9.9,0.25; 38 9.9,0.75; 39 9.9,1.25; 40 9.9,1.75; 41 9.9,2.25; 42 9.9,2.75; 43 9.9,3.25; 44 9.9,3.75; 45 9.9,4.25; 46 9.9,4.75; 47 9.9,5.25; 48 9.9,5.75
SSOP28 = smd 0.35 x 1.75: 1 -4.225,-3.525; 2 -3.575,-3.525; 3 -2.925,-3.525; 4 -2.275,-3.525; 5 -1.625,-3.525; 6 -0.975,-3.525; 7 -0.325,-3.525; 8 0.325,-3.525; 9 0.975,-3.525; 10 1.625,-3.525; 11 2.275,-3.525; 12 2.925,-3.525; 13 3.575,-3.525; 14 4.225,-3.525; 15 4.225,3.525; 16 3.575,3.525; 17 2.925,3.525; 18 2.275,3.525; 19 1.625,3.525; 20 0.975,3.525; 21 0.325,3.525; 22 -0.325,3.525; 23 -0.975,3.525; 24 -1.625,3.525; 25 -2.275,3.525; 26 -2.925,3.525; 27 -3.575,3.525; 28 -4.225,3.525
SO-8 = smd 0.6 x 2.2: 1 -1.905,-2.6; 2 -0.635,-2.6; 3 0.635,-2.6; 4 1.905,-2.6; 5 1.905,2.6; 6 0.635,2.6; 7 -0.635,2.6; 8 -1.905,2.6
SLP2510P8 = smd 0.2 x 0.675: 1 -1,-0.438; 2 -0.5,-0.438; 4 0.5,-0.438; 5 1,-0.438; 6 1,0.438; 7 0.5,0.438; 9 -0.5,0.438; 10 -1,0.438 | smd 0.4 x 0.775: 3 0,-0.388; 8 0,0.388
QFN48 = smd 0.2 x 0.9: 1 -2.2,-3; 2 -1.8,-3; 3 -1.4,-3; 4 -1,-3; 5 -0.6,-3; 6 -0.2,-3; 7 0.2,-3; 8 0.6,-3; 9 1,-3; 10 1.4,-3; 11 1.8,-3; 12 2.2,-3; 25 2.2,3; 26 1.8,3; 27 1.4,3; 28 1,3; 29 0.6,3; 30 0.2,3; 31 -0.2,3; 32 -0.6,3; 33 -1,3; 34 -1.4,3; 35 -1.8,3; 36 -2.2,3 | smd 0.9 x 0.2: 13 3,-2.2; 14 3,-1.8; 15 3,-1.4; 16 3,-1; 17 3,-0.6; 18 3,-0.2; 19 3,0.2; 20 3,0.6; 21 3,1; 22 3,1.4; 23 3,1.8; 24 3,2.2; 37 -3,2.2; 38 -3,1.8; 39 -3,1.4; 40 -3,1; 41 -3,0.6; 42 -3,0.2; 43 -3,-0.2; 44 -3,-0.6; 45 -3,-1; 46 -3,-1.4; 47 -3,-1.8; 48 -3,-2.2 | drill 1.2 pad 1.422 square: N1 0,0 | drill 0.3 pad 0.4 square: N2 -1.6,0.65; N3 -1,0.65; N4 -1.6,-0.65; N5 -1,-0.65; N6 -0.65,-1.6; N7 -0.65,-1; N8 0.65,-1.6; N9 0.65,-1; N10 1.6,-0.65; N11 1,-0.65; N12 1.6,0.65; N13 1,0.65; N14 0.65,1.6; N15 0.65,1; N16 -0.65,1.6; N17 -0.65,1 | smd 4 x 4: VSS 0,0
SOT23' = smd 1 x 1.4: 1 -0.95,-1.1; 2 0.95,-1.1; 3 0,1.1
XBEE&XBEE-PRO_RPSMA = drill 0.7 square: 1 -11,9 | drill 0.7 round: 2 -11,7; 3 -11,5; 4 -11,3; 5 -11,1; 6 -11,-1; 7 -11,-3; 8 -11,-5; 9 -11,-7; 10 -11,-9; 11 11,-9; 12 11,-7; 13 11,-5; 14 11,-3; 15 11,-1; 16 11,1; 17 11,3; 18 11,5; 19 11,7; 20 11,9
SOT23-6 = smd 0.55 x 1.2: 1 -0.95,-1.3; 2 0,-1.3; 3 0.95,-1.3; 4 0.95,1.3; 5 0,1.3; 6 -0.95,1.3
FIDUCIAL-1X3 = smd 1 x 1: 1 0,0
HN1X3 = drill 1 pad 1.778 square: 1 -2.54,0 | drill 1 pad 1.778 round: 2 0,0; 3 2.54,0
USB_A_VERTICAL_PTH = drill 1 round: 1 3.45,12.75; 2 3.45,14.75; 3 3.45,16.75; 4 3.45,18.75 | drill 1.5 round: P$1 0.6,12.25; P$2 6.3,12.25; P$3 6.3,19.25; P$4 0.6,19.25
USB_MINI_9PIN = smd 2.25 x 0.5: D+ 2.706,0; D- 2.706,0.8; GND 2.706,-1.6; ID 2.706,-0.8; VBUS 2.706,1.6 | smd 4 x 2.1: GND1 -1.9,4.95; GND3 -1.9,-4.95 | smd 3.5 x 2.1: GND2 2.35,4.95; GND4 2.35,-4.95 | hole 1: 0,2.2; 0,-2.2
SOT-23-5 = smd 0.55 x 1.2: 1 -0.95,-1.3; 2 0,-1.3; 3 0.95,-1.3; 4 0.95,1.3; 5 -0.95,1.3
SJ_2_SMALL_12_TIED = smd 0.762 x 1.016: 1 -1.143,0; 2 0,0; 3 1.143,0

## Placement (x,y rotation side)
1.2V_CPU  TESTPADTESTPAD_40-ROUND  [TESTPAD_40-ROUND]  54.23,50.8 0 bottom
1.2V_INT  TESTPADTESTPAD_40-ROUND  [TESTPAD_40-ROUND]  49.28,41.02 0 bottom
1.5V  TESTPADTESTPAD_40-ROUND  [TESTPAD_40-ROUND]  48.01,47.88 0 bottom
2.5V  TESTPADTESTPAD_40-ROUND  [TESTPAD_40-ROUND]  22.73,36.32 0 bottom
3.0VA  TESTPADTESTPAD_40-ROUND  [TESTPAD_40-ROUND]  20.07,49.78 0 bottom
3.3V  TESTPADTESTPAD_40-ROUND  [TESTPAD_40-ROUND]  50.04,47.88 0 bottom
5V_E  Open  [SJ_1_SMALLER]  75.25,58.79 0 bottom
5V_E_SATA  Open  [SJ_1_SMALLER]  7.49,57.53 0 bottom
5V_SATA_PWR  DW02R  [DW02R]  4.45,54.99 270 top
5VEXT  TESTPADTESTPAD_40-ROUND  [TESTPAD_40-ROUND]  65.79,51.44 0 bottom
+5V  TESTPADTESTPAD_40-ROUND  [TESTPAD_40-ROUND]  11.56,37.47 0 bottom
ASSOC_LED  LED/RED/0603  [LED-0603]  165.75,48.09 180 top
BAT  TESTPADTESTPAD_40-ROUND  [TESTPAD_40-ROUND]  70.61,42.16 0 bottom
C1  220nF  [C0402_TI]  64.71,17.91 180 top
C2  220nF  [C0402_TI]  56.32,18.41 270 top
C3  220nF  [C0402_TI]  43.46,24.05 180 bottom
C4  220nF  [C0402_TI]  43.36,25.04 180 bottom
C5  220nF  [C0402_TI]  43.46,27.79 180 bottom
C6  220nF  [C0402_TI]  43.46,28.68 180 bottom
C7  220nF  [C0402_TI]  44.77,25.91 270 bottom
C8  220nF  [C0402_TI]  43.46,31.57 180 bottom
C9  220nF  [C0402_TI]  63.25,21.59 0 bottom
C10  220nF  [C0402_TI]  57.85,22.22 180 bottom
C11  220nF  [C0402_TI]  43.05,33.1 90 bottom
C12  220nF  [C0402_TI]  43.99,33.1 90 bottom
C13  220nF  [C0402_TI]  55.44,18.41 270 top
C14  220nF  [C0402_TI]  62.36,18.41 90 top
C15  220nF  [C0402_TI]  61.21,21.59 0 bottom
C16  220nF  [C0402_TI]  51.05,21.84 0 top
C17  220nF  [C0402_TI]  56.77,25.65 270 bottom
C18  220nF  [C0402_TI]  60.71,39.37 0 bottom
C19  220nF  [C0402_TI]  61.09,32.51 0 bottom
C20  220nF  [C0402_TI]  56.64,39.37 0 bottom
C21  220nF  [C0402_TI]  60.25,22.97 180 bottom
C22  220nF  [C0402_TI]  57.58,36.07 180 bottom
C23  220nF  [C0402_TI]  61.55,25.92 270 bottom
C24  22uF/6.3V  [C0603_DWS]  47.12,41.02 180 bottom
C25  220nF  [C0402_TI]  43.46,29.57 0 bottom
C26  220nF  [C0402_TI]  43.46,30.56 0 bottom
C27  220nF  [C0402_TI]  38.28,29.29 270 bottom
C28  220nF  [C0402_TI]  66.8,28.58 90 bottom
C29  220nF  [C0402_TI]  66.8,37.21 90 top
C30  220nF  [C0402_TI]  66.8,28.58 90 top
C31  220nF  [C0402_TI]  66.8,24.26 90 top
C32  220nF  [C0402_TI]  66.8,30.73 270 top
C33  220nF  [C0402_TI]  66.8,24.26 90 bottom
C34  220nF  [C0402_TI]  66.8,30.73 270 bottom
C35  220nF  [C0402_TI]  64.64,37.97 0 bottom
C36  220nF  [C0402_TI]  66.8,22.1 270 top
C37  220nF  [C0402_TI]  58.67,39.37 180 bottom
C38  220nF  [C0402_TI]  57.02,40.51 180 top
C39  220nF  [C0402_TI]  54.23,39.37 180 bottom
C40  220nF  [C0402_TI]  53.85,40.51 0 top
C41  220nF  [C0402_TI]  58.17,37.59 270 bottom
C42  220nF  [C0402_TI]  51.05,22.86 0 top
C43  220nF  [C0402_TI]  62.74,39.37 0 bottom
C44  220nF  [C0402_TI]  51.18,39.75 90 top
C45  220nF  [C0402_TI]  55.37,31.11 0 bottom
C46  220nF  [C0402_TI]  37.21,23.5 90 bottom
C47  220nF  [C0402_TI]  36.53,27.94 0 bottom
C48  220nF  [C0402_TI]  36.19,31.5 180 bottom
C49  220nF  [C0402_TI]  38.28,27.36 270 bottom
C50  220nF  [C0402_TI]  33.86,24.87 180 bottom
C51  220nF  [C0402_TI]  43.36,26.9 0 bottom
C52  220nF  [C0402_TI]  40.79,27.94 180 bottom
C53  220nF  [C0402_TI]  41.17,33.1 270 bottom
C54  220nF  [C0402_TI]  40.23,33.1 270 bottom
C55  220nF  [C0402_TI]  42.11,33.1 270 bottom
C56  220nF  [C0402_TI]  66.8,32.89 90 top
C57  220nF  [C0402_TI]  66.8,22.1 270 bottom
C58  220nF  [C0402_TI]  66.8,32.89 90 bottom
C59  220nF  [C0402_TI]  66.8,37.21 90 bottom
C60  220nF  [C0402_TI]  66.8,26.42 270 top
C61  220nF  [C0402_TI]  66.8,35.05 270 top
C62  220nF  [C0402_TI]  66.8,26.42 270 bottom
C63  220nF  [C0402_TI]  62.67,37.97 0 bottom
C64  220nF  [C0402_TI]  66.8,35.05 270 bottom
C65  220nF  [C0402_TI]  39.98,23.5 90 bottom
C66  220nF  [C0402_TI]  54.74,49.78 0 bottom
C67  220nF  [C0402_TI]  39.01,23.5 90 bottom
C68  220nF  [C0402_TI]  36.25,23.5 90 bottom
C69  220nF  [C0402_TI]  38.11,23.5 90 bottom
C70  220nF  [C0402_TI]  38.28,25.43 270 bottom
C71  100nF  [C0603_MM]  101.32,11.89 90 bottom
C72  22uF/6.3V  [C0603_DWS]  102.85,11.89 90 bottom
C73  220nF  [C0402_TI]  39.29,33.1 90 bottom
C74  220nF  [C0402_TI]  36.45,33.1 90 bottom
C75  220nF  [C0402_TI]  38.35,33.15 90 bottom
C76  100nF  [C0402_TI]  18.41,41.27 180 top
C77  100nF  [C0402_TI]  20.7,41.27 0 top
C78  100nF  [C0402_TI]  20.19,18.41 0 top
C79  NA  [C0402_TI]  53.66,18.41 270 top
C80  100nF  [C0603_MM]  94.95,2.59 90 top
C81  100nF  [C0603_MM]  96.45,8.79 90 bottom
C82  22uF/6.3V  [C0603_DWS]  93.65,12.19 0 bottom
C83  33pF  [C0603_DWS]  93.9,18.34 0 top
C84  33pF  [C0603_DWS]  90.25,18.34 180 top
C85  220nF  [C0402_TI]  33.86,31.32 0 bottom
C86  220nF  [C0402_TI]  38.66,35.08 0 bottom
C87  220nF  [C0402_TI]  33.86,27.69 180 bottom
C88  220nF  [C0402_TI]  37.59,16.79 90 top
C89  220nF  [C0402_TI]  38.28,31.22 90 bottom
C90  220nF  [C0402_TI]  43.46,22.99 0 bottom
C91  220nF  [C0402_TI]  41.91,23.5 90 bottom
C92  220nF  [C0402_TI]  40.94,23.5 90 bottom
C93  220nF  [C0402_TI]  35.28,23.5 90 bottom
C94  100nF  [C0603_MM]  90.65,11.19 90 bottom
C95  100nF  [C0603_MM]  103.65,15.89 270 bottom
C96  22uF/6.3V  [C0603_DWS]  102.05,15.89 270 bottom
C97  220nF  [C0402_TI]  33.86,23.95 0 bottom
C98  220nF  [C0402_TI]  33.86,22.99 0 bottom
C99  1uF  [C0603_DWS]  37.45,14.99 180 top
C100  100nF  [C0402_TI]  36.13,16.32 180 top
C101  10pF  [C0402_TI]  45.84,16.96 0 bottom
C102  10pF  [C0402_TI]  43.91,16.96 180 bottom
C103  100nF  [C0603_MM]  98.45,16.79 0 top
C104  100nF  [C0603_MM]  110.55,21.79 90 top
C105  100nF  [C0603_MM]  116.15,21.79 90 top
C106  100nF  [C0603_MM]  104.35,7.69 180 bottom
C107  33pF  [C0603_DWS]  25.15,27.56 90 bottom
C108  33pF  [C0603_DWS]  25.15,30.86 270 bottom
C109  22uF/6.3V  [C0603_DWS]  51.31,18.67 90 top
C110  100nF  [C0402_TI]  43.36,25.93 0 bottom
C111  22uF/6.3V  [C0603_DWS]  31.62,41.02 180 top
C112  220nF  [C0402_TI]  34.01,30.43 180 bottom
C113  100nF  [C0603_MM]  90.95,53.19 270 bottom
C114  22uF/6.3V  [C0603_DWS]  25.78,34.16 90 bottom
C115  100uF/16V/LOWESR/105C/6.3x11mm_RM2.5  [E2,5-6,3]  93.25,44.99 90 top
C116  10uF/6.3V  [C0603_DWS]  115.55,36.69 180 top
C117  1uF  [C0603_DWS]  26.54,44.7 180 bottom
C118  220nF  [C0402_TI]  26.54,42.61 180 bottom
C119  10uF/6.3V  [C0603_DWS]  131.85,4.29 270 top
C120  10uF/6.3V  [C0603_DWS]  25.91,41.27 0 top
C121  100nF  [C0603_MM]  100.95,53.19 270 bottom
C122  10uF/6.3V  [C0603_DWS]  25.91,44.32 0 top
C123  10uF/6.3V  [C0603_DWS]  99.22,40.09 90 top
C124  100uF/16V/LOWESR/105C/6.3x11mm_RM2.5  [E2,5-6,3]  103.25,44.99 90 top
C125  220nF  [C0402_TI]  26.54,43.5 180 bottom
C126  100nF  [C0603_MM]  100.75,40.09 90 top
C127  1uF  [C0603_DWS]  108.95,29.69 90 top
C128  100nF  [C0603_MM]  110.95,53.19 270 bottom
C129  220nF  [C0402_TI]  22.48,22.73 270 bottom
C130  100uF/16V/LOWESR/105C/6.3x11mm_RM2.5  [E2,5-6,3]  113.25,44.99 90 top
C131  220nF  [C0402_TI]  21.21,22.73 270 bottom
C132  100nF  [C0603_MM]  96.15,37.29 90 top
C133  10uF/6.3V  [C0603_DWS]  108.85,37.19 270 top
C134  100nF  [C0603_MM]  93.55,27.69 270 top
C135  100nF  [C0603_MM]  96.75,27.69 270 top
C136  100nF  [C0603_MM]  106.25,26.69 0 top
C137  220nF  [C0402_TI]  33.15,39.24 270 top
C138  220nF  [C0402_TI]  34.04,39.24 270 top
C139  10uF/6.3V  [C0603_DWS]  35.56,39.37 270 bottom
C140  33pF  [C0603_DWS]  99.35,26.69 0 top
C141  10pF  [C0402_TI]  86.55,31.19 90 top
C142  33pF  [C0603_DWS]  102.8,26.69 180 top
C143  100nF  [C0603_MM]  86.55,35.19 90 top
C144  100nF  [C0603_MM]  120.95,53.19 270 bottom
C145  100uF/16V/LOWESR/105C/6.3x11mm_RM2.5  [E2,5-6,3]  133.25,44.99 90 top
C146  22uF/6.3V  [C0603_DWS]  115.3,28.09 180 top
C147  1nF  [C0402_TI]  55.88,54.61 90 bottom
C148  1nF  [C0402_TI]  55.88,58.42 270 bottom
C149  1nF  [C0402_TI]  57.15,54.61 90 bottom
C150  1nF  [C0402_TI]  57.15,58.42 270 bottom
C151  100nF  [C0603_MM]  130.95,53.19 270 bottom
C152  100uF/16V/LOWESR/105C/6.3x11mm_RM2.5  [E2,5-6,3]  123.25,44.99 90 top
C153  22uF/6.3V  [C0603_DWS]  124.85,40.09 90 top
C154  22uF/6.3V  [C0603_DWS]  19.94,22.35 270 bottom
C155  100nF  [C0603_MM]  123.32,40.09 90 top
C156  220nF  [C0402_TI]  33.86,26.8 180 bottom
C157  22uF/6.3V  [C0603_DWS]  50.67,42.67 90 top
C158  1uF  [C0603_DWS]  132.85,29.69 90 top
C159  220nF  [C0402_TI]  33.86,25.83 180 bottom
C160  100nF  [C0603_MM]  140.95,53.19 270 bottom
C161  100uF/16V/LOWESR/105C/6.3x11mm_RM2.5  [E2,5-6,3]  143.25,44.99 90 top
C162  100nF  [C0603_MM]  133.15,37.19 270 top
C163  22uF/6.3V  [C0603_DWS]  120.35,37.29 90 top
C164  100nF  [C0603_MM]  117.7,27.69 270 top
C165  100nF  [C0603_MM]  120.75,27.69 270 top
C166  100nF  [C0603_MM]  131.45,26.69 0 top
C167  100uF/16V/LOWESR/105C/6.3x11mm_RM2.5  [E2,5-6,3]  153.25,44.99 90 top
C168  100nF  [C0603_MM]  150.95,53.19 270 bottom
C169  33pF  [C0603_DWS]  123.25,26.69 0 top
C170  33pF  [C0603_DWS]  127.55,26.69 180 top
C171  10uF/6.3V  [C0603_DWS]  71.88,39.5 0 bottom
C172  220nF  [C0402_TI]  37.39,33.1 90 bottom
C173  10nF  [C0402_TI]  8.64,40.13 0 bottom
C174  22uF/6.3V  [C0603_DWS]  43.81,41.02 0 bottom
C175  10nF  [C0402_TI]  8.64,41.02 0 bottom
C176  10uF/6.3V  [C0603_DWS]  65.66,39.24 180 bottom
C177  1uF  [C0603_DWS]  72.9,46.13 0 bottom
C178  10nF  [C0402_TI]  8.64,43.94 0 bottom
C179  10uF/6.3V  [C0603_DWS]  75.25,42.39 270 top
C180  10uF/6.3V  [C0603_DWS]  72.9,47.65 180 bottom
C181  10uF/6.3V  [C0603_DWS]  69.85,47.99 90 bottom
C182  10nF  [C0402_TI]  8.64,44.83 0 bottom
C183  10uF/6.3V  [C0603_DWS]  65.15,42.93 270 bottom
C184  10uF/6.3V  [C0603_DWS]  53.09,50.04 90 top
C185  1nF  [C0402_TI]  54.36,50.42 90 top
C186  10uF/6.3V  [C0603_DWS]  66.93,51.18 0 top
C187  1uF  [C0603_DWS]  59.06,41.53 90 bottom
C188  22uF/6.3V  [C0603_DWS]  23.49,34.16 90 bottom
C189  220nF  [C0402_TI]  33.86,29.54 180 bottom
C190  22uF/6.3V  [C0603_DWS]  7.49,54.99 90 bottom
C191  NA(22uF/6.3V)  [C0603_DWS]  5.97,54.99 90 bottom
C192  10uF/6.3V  [C0603_DWS]  53.47,44.45 90 top
C193  1nF  [C0402_TI]  52.2,44.45 90 top
C194  10uF/6.3V  [C0603_DWS]  60.2,49.17 90 bottom
C195  22uF/6.3V  [C0603_DWS]  49.15,42.67 90 top
C196  1uF  [C0603_DWS]  62.1,42.93 270 bottom
C197  220nF  [C0402_TI]  33.86,28.58 180 bottom
C198  100nF  [C0402_TI]  7.81,51.69 90 bottom
C199  10uF/6.3V  [C0603_DWS]  63.63,42.93 90 bottom
C200  1uF  [C0603_DWS]  59.69,40.64 0 top
C201  10uF/6.3V  [C0603_DWS]  60.58,41.53 90 bottom
C202  10uF/6.3V  [C0603_DWS]  58.67,49.17 90 bottom
C203  220nF  [C0402_TI]  33.63,33.1 270 bottom
C204  10uF/6.3V  [C0603_DWS]  71.88,42.55 0 top
C205  22uF/6.3V  [C0603_DWS]  21.97,34.16 90 bottom
C206  10uF/6.3V  [C0603_DWS]  71.88,41.02 0 top
C207  220nF  [C0402_TI]  35.51,33.1 270 bottom
C208  1nF  [C0402_TI]  69.98,48.34 270 top
C209  22uF/6.3V  [C0603_DWS]  35.18,44.07 0 top
C210  10uF/6.3V  [C0603_DWS]  56.52,49.17 90 bottom
C211  220nF  [C0402_TI]  34.57,33.1 270 bottom
C212  220nF  [C0402_TI]  34.92,42.8 0 top
C213  22uF/6.3V  [C0603_DWS]  31.62,42.55 180 top
C214  220nF  [C0402_TI]  34.92,41.53 0 top
C215  22uF/6.3V  [C0603_DWS]  19.43,50.55 0 top
C216  22uF/6.3V  [C0603_DWS]  19.69,43.69 180 top
C217  100nF  [C0402_TI]  20.07,44.96 180 top
C218  470uF/10V/105C  [E2,5-6,3]  85.05,44.99 90 top
C219  100nF  [C0603_MM]  158.55,47.19 180 top
C220  22uF/6.3V  [C0603_DWS]  16.38,7.75 0 bottom
C221  22uF/6.3V  [C0603_DWS]  16.38,9.27 0 bottom
C222  33pF  [C0603_DWS]  46.74,45.72 270 bottom
C223  22uF/6.3V  [C0603_DWS]  51.82,45.72 270 bottom
C224  22uF/6.3V  [C0603_DWS]  53.34,45.72 270 bottom
C225  22uF/6.3V  [C0603_DWS]  54.36,41.47 90 bottom
C226  22uF/6.3V  [C0603_DWS]  77.72,42.05 180 bottom
C227  22uF/6.3V  [C0603_DWS]  77.72,40.52 180 bottom
C228  22uF/6.3V  [C0603_DWS]  66.65,56.99 90 top
C229  22uF/6.3V  [C0603_DWS]  77.22,48.09 180 bottom
C230  22uF/6.3V  [C0603_DWS]  31.75,52.96 90 bottom
C231  33pF  [C0603_DWS]  25.78,57.78 270 top
C232  22uF/6.3V  [C0603_DWS]  27.3,57.78 270 bottom
C233  22uF/6.3V  [C0603_DWS]  25.78,57.78 270 bottom
C234  100nF  [C0402_TI]  18.92,15.75 90 bottom
C235  100nF  [C0402_TI]  25.78,13.21 270 bottom
C236  100nF  [C0402_TI]  18.92,11.56 270 bottom
C237  1nF  [C0402_TI]  24.51,51.05 180 bottom
C238  22uF/6.3V  [C0603_DWS]  25.15,15.75 0 bottom
C239  1nF/2kV/X7R/1206  [C1206_5MILS_WS_ISO]  126.45,6.09 180 bottom
CHGLED  LED/YELLOW/0603  [LED-0603]  78.75,38.89 90 top
D1  1N5819(S4SOD-123)  [SOD-123]  52.45,52.96 0 bottom
D2  BAT54C  [SOT23C]  83.65,33.99 270 top
D3  1N5819(S4SOD-123)  [SOD-123]  68.83,4.06 0 bottom
D4  SMBJ6.0A  [DO214AA]  79.65,57.89 180 bottom
D5  NA(1N5822/SS34/SMA)  [MLL-41]  74.95,53.99 90 bottom
D6  1N5822/SS34/SMA  [MELF-MLL41]  78.85,37.59 180 bottom
FET1  IRLML6402  [SOT23]  10.29,57.28 270 bottom
FET2  BSS138  [SOT23]  71.65,51.69 270 bottom
FET3  IRLML6402  [SOT23]  71.65,57.39 0 bottom
FET4  IRLML6402  [SOT23]  72.56,51.04 0 top
FUSE1  FSMD035  [1206]  11.56,31.75 270 bottom
GND  TESTPADTESTPAD_40-ROUND  [TESTPAD_40-ROUND]  21.25,58.69 0 bottom
GND_PIN  TESTPAD3  [TEST_PAD40/70/SQUARE]  26.16,1.27 0 top
GPIO-1  GPH127SMT-02X20(PA-V16X-2X20-LF)  [GPH127SMT-02X20(PA-V16X-2X20-LF)]  38.1,50.16 0 top
GPIO-2  GPH127SMT-02X20(PA-V16X-2X20-LF)  [GPH127SMT-02X20(PA-V16X-2X20-LF)]  38.1,9.52 0 top
GPIO-3  GPH127SMT-02X20(PA-V16X-2X20-LF)  [GPH127SMT-02X20(PA-V16X-2X20-LF)]  45.08,3.17 0 top
GPIO-4  GPH127SMT-02X10(PA-V16X-2X10-LF)  [GPH127SMT-02X10(PA-V16X-2X10-LF)]  14.86,53.09 90 top
HDMI  HDMI-SWM-19  [HDMI-SWM-19]  4.19,25.27 90 top
IPSOUT  TESTPADTESTPAD_40-ROUND  [TESTPAD_40-ROUND]  58.8,45.59 0 bottom
L1  FB0805/600R/2A  [L0805_5MIL_DWS]  103.25,15.69 90 top
L2  FB0805/600R/2A  [L0805_5MIL_DWS]  93.65,10.19 180 bottom
L3  FB0805/600R/2A  [L0805_5MIL_DWS]  98.25,12.74 180 bottom
L4  FB0805/600R/2A  [L0805_5MIL_DWS]  118.25,45.79 90 top
L5  FB0805/600R/2A  [L0805_5MIL_DWS]  95.35,44.99 90 bottom
L6  FB0805/600R/2A  [L0805_5MIL_DWS]  105.35,44.99 90 bottom
L7  FB0805/600R/2A  [L0805_5MIL_DWS]  115.35,44.99 90 bottom
L8  FB0805/600R/2A  [L0805_5MIL_DWS]  95.85,33.19 270 top
L9  FB0805/600R/2A  [L0805_5MIL_DWS]  128.15,44.99 90 top
L10  FB0805/600R/2A  [L0805_5MIL_DWS]  125.35,44.99 90 bottom
L11  FB0805/600R/2A  [L0805_5MIL_DWS]  135.35,44.99 90 bottom
L12  FB0805/600R/2A  [L0805_5MIL_DWS]  145.35,44.99 90 bottom
L13  FB0805/600R/2A  [L0805_5MIL_DWS]  120.15,33.19 270 top
L14  FB0805/600R/2A  [L0805_5MIL_DWS]  155.35,44.99 90 bottom
L15  2.2uH/1.5A/DCR<0.1R/CD32  [CD32]  72.39,46.23 270 top
L16  2.2uH/1.5A/DCR<0.1R/CD32  [CD32]  56.77,50.93 270 top
L17  2.2uH/1.5A/DCR<0.1R/CD32  [CD32]  56.26,45.21 270 top
L18  2.2uH/1.5A/DCR<0.1R/CD32  [CD32]  56.13,45.21 90 bottom
L19  CL470nH/0805/0.3R/250mA  [L0805_5MIL_DWS]  16.13,5.21 0 bottom
L20  2.2uH/1.5A/DCR<0.1R/CD32  [CD32]  81.55,44.39 270 bottom
L21  FB0805/600R/2A  [L0805_5MIL_DWS]  21.46,15.75 180 bottom
L22  2.2uH/1.5A/DCR<0.1R/CD32  [CD32]  30.35,57.4 0 bottom
L23  FB0805/600R/2A  [L0805_5MIL_DWS]  9.4,3.17 270 top
LAN  RJLBC-060TC1  [RJLBC-060TC1_MILLING]  115.86,8.51 0 top
LCD_CON  GPH127SMT-02X20(PA-V16X-2X20-LF)  [GPH127SMT-02X20(PA-V16X-2X20-LF)]  45.08,56.52 0 top
LED1  LED/GREEN/0603  [LED-0603]  28.7,2.16 90 top
LIPO_BAT  DW02R  [DW02R]  71.75,54.69 180 top
MICRO_SD  MICRO_SD/TFC-WPAPR-08  [TFC-WPAPR-08]  5.45,8.63 0 bottom
NAND_E  Close  [SJ_1_SMALLER_CLOSE_10MILS]  19.81,36.19 270 bottom
PC3/PB8  PC3:Closed/PB8:Opened  [SJ_2_SMALL_23_TIED]  10.29,47.24 180 bottom
PUSH_BUT  SIDE_WTCM-TR(3X4)  [SW_TAKT3X4]  163.23,56.9 0 top
PWR  SIDE_WTCM-TR(3X4)  [SW_TAKT3X4]  1.27,54.36 270 bottom
PWR_JACK  YDJ-1136  [PWR_JACK_UNI_MILLING]  77.05,48.74 270 top
PWR_LED  LED/RED/0603  [LED-0603]  81.45,38.89 90 top
Q1  4SB25.000F20E15/5x3.2mm/20ppm/20pF  [HCX-4S]  91.85,15.89 0 top
Q2  MC-306_32.768KHZ/SMD_8038/6pF  [MC-306]  44.45,12.45 270 bottom
Q3  4SB24.000F20E15/5x3.2mm/20ppm/20pF  [HCX-4S]  22.61,29.21 270 bottom
Q4  MC-306_32.768KHZ/SMD_8038/6pF  [MC-306]  89.85,25.89 270 top
Q5  Q12.000MHz/HC-49SM/SMD/20ppm/20pF  [HC49/SMD2_THIN&SHORT]  101.45,23.19 180 top
Q6  Q12.000MHz/HC-49SM/SMD/20ppm/20pF  [HC49/SMD2_THIN&SHORT]  127.25,23.19 180 top
R1  2k/1%  [R0402_TI]  64.71,18.92 0 top
R2  2k/1%  [R0402_TI]  57.21,18.41 90 top
R3  NA  [R0402_TI]  58.1,18.41 270 top
R4  2k/1%  [R0402_TI]  63.25,18.41 90 top
R5  2k/1%  [R0402_TI]  54.55,18.41 270 top
R6  2k/1%  [R0402_TI]  46.36,37.85 0 bottom
R7  330R/1%  [R0603_5MIL_DWS]  63.72,35.49 0 bottom
R8  330R/1%  [R0603_5MIL_DWS]  62.15,24.19 0 bottom
R9  22R  [R0402_TI]  50.29,32.89 180 top
R10  22R  [R0402_TI]  50.29,33.78 180 top
R11  0R(Board_Mounted)  [R0402_TI_0R]  46.36,36.96 0 bottom
R12  10k  [R0402_TI]  22.73,41.27 0 top
R13  10k  [R0402_TI]  21.72,42.16 0 top
R14  NA  [R0402_TI]  18.22,36.19 90 bottom
R15  10k  [R0402_TI]  18.41,42.16 180 top
R16  0R(Board_Mounted)  [R0402_TI_0R]  46.36,36.07 0 bottom
R17  330R/1%  [R0603_5MIL_DWS]  43.81,39.5 0 bottom
R18  NA(2.2k)  [R0402_TI]  73.65,13.39 270 bottom
R19  NA(2.2k)  [R0402_TI]  72.65,13.39 90 bottom
R20  2k/1%  [R0402_TI]  102.25,8.79 270 bottom
R21  10k  [R0402_TI]  54.61,55.12 270 bottom
R22  10k  [R0402_TI]  36.13,17.21 0 top
R23  681R/1%  [R0603_5MIL_DWS]  104.35,3.29 0 bottom
R24  NA  [R0603_5MIL_DWS]  98.45,19.84 0 top
R25  681R/1%  [R0603_5MIL_DWS]  104.35,6.09 0 bottom
R26  NA  [R0603_5MIL_DWS]  98.45,18.32 0 top
R27  10M  [R0402_TI]  44.62,17.86 0 bottom
R28  NA  [R0603_5MIL_DWS]  112.85,36.89 90 top
R29  10k  [R0603MM]  112.85,40.19 270 top
R30  6.81k/1%  [R0603_5MIL_DWS]  117.65,42.99 180 top
R31  200k/1%  [R0603_5MIL_DWS]  25.91,42.8 180 top
R32  10k  [R0603MM]  105.38,40.09 270 top
R33  10k  [R0603MM]  108.95,32.59 90 bottom
R34  10k  [R0603MM]  106.95,40.09 270 top
R35  NA(47k)  [R0603_5MIL_DWS]  108.95,29.09 270 bottom
R36  NA(5.1k)  [R0603_5MIL_DWS]  102.3,40.09 90 top
R37  681R/1%  [R0603_5MIL_DWS]  95.15,27.69 90 top
R38  NA(0R)  [R0603_5MIL_DWS]  42.61,40.39 90 top
R39  NA(10k)  [R0603_5MIL_DWS]  103.85,40.09 270 top
R40  2.2k  [R0603MM]  93.35,40.69 0 top
R41  2.2k  [R0603MM]  93.35,39.09 0 top
R42  2.2k  [R0402_TI]  46.23,45.72 270 top
R43  2.2k  [R0402_TI]  45.34,45.72 270 top
R44  NA  [R0603_5MIL_DWS]  112.85,33.59 270 top
R45  10k  [R0603MM]  112.85,30.29 270 top
R46  6.81k/1%  [R0603_5MIL_DWS]  115.55,35.09 180 top
R47  10k  [R0402_TI]  10.92,3.17 90 top
R48  NA  [R0603_5MIL_DWS]  51.69,54.86 0 bottom
R49  NA  [R0603_5MIL_DWS]  51.69,56.39 0 bottom
R50  10k  [R0603MM]  129.43,40.09 270 top
R51  10k  [R0603MM]  132.85,32.59 90 bottom
R52  10k  [R0603MM]  130.95,40.09 270 top
R53  NA(47k)  [R0603_5MIL_DWS]  132.85,29.09 270 bottom
R54  681R/1%  [R0603_5MIL_DWS]  119.22,27.69 90 top
R55  NA(5.1k)  [R0603_5MIL_DWS]  126.38,40.09 90 top
R56  10k  [R0402_TI]  70.1,5.71 180 bottom
R57  2k/1%  [R0402_TI]  13.34,32.13 90 top
R58  NA(10k)  [R0603_5MIL_DWS]  127.9,40.09 270 top
R59  2k/1%  [R0402_TI]  12.45,32.13 90 top
R60  100k/1%  [R0603_5MIL_DWS]  13.46,31.75 90 bottom
R61  191R/1%  [R0603_5MIL_DWS]  71.88,39.5 180 top
R62  0.03R/1%  [R1206_5MIL_WS]  72.44,42.83 90 bottom
R63  191R/1%  [R0603_5MIL_DWS]  26.54,40.89 180 bottom
R64  100k/1%  [R0603_5MIL_DWS]  85.35,50.69 180 bottom
R65  10k  [R0402_TI]  10.29,54.48 180 bottom
R66  2.2k  [R0603MM]  78.75,42.39 270 top
R67  200k/1%  [R0603_5MIL_DWS]  85.35,52.99 0 bottom
R68  10k  [R0402_TI]  9.78,48.89 180 bottom
R69  200k/1%  [R0603_5MIL_DWS]  59.69,42.16 0 top
R70  4.99k/1%  [R0603_5MIL_DWS]  6.6,51.69 270 bottom
R71  2.2k  [R0402_TI]  69.09,48.34 270 top
R72  100k/1%  [R0603_5MIL_DWS]  68.75,56.69 90 bottom
R73  2.2k  [R0402_TI]  66.93,49.91 180 top
R74  10k  [R0603MM]  77.15,42.39 270 top
R75  2.2k  [R0402_TI]  67.18,51.18 90 bottom
R76  2.2k  [R0402_TI]  63.24,40.34 180 top
R77  2.2k  [R0402_TI]  68.07,51.18 90 bottom
R78  100k/1%  [R0603_5MIL_DWS]  16.38,12.32 180 bottom
R79  NA  [R0603_5MIL_DWS]  158.55,45.19 0 top
R80  2.2k  [R0603MM]  80.35,42.39 270 top
R81  0R(Board_Mounted)  [0603_0R]  66.75,56.69 270 bottom
R82  10k  [R0402_TI]  16.38,10.54 180 bottom
R83  10k  [R0603MM]  161.95,42.49 0 top
R84  2.2k  [R0603MM]  161.95,44.29 0 top
R85  2.2k  [R0603MM]  161.95,46.19 0 top
R86  10k  [R0603MM]  158.55,43.39 180 top
R87  2.2k  [R0402_TI]  29.97,2.54 90 top
R88  2.2k  [R0603MM]  161.95,48.09 0 top
R89  200k/1%  [R0603_5MIL_DWS]  75.35,50.79 270 top
R90  681R/1%  [R0603_5MIL_DWS]  127.35,19.39 180 top
R91  NA(2.2k)  [R0603_5MIL_DWS]  161.95,53.09 0 top
R92  NA(2.2k)  [R0603_5MIL_DWS]  161.95,50.59 0 top
R93  4.99k/1%  [R0603_5MIL_DWS]  48.77,45.72 270 bottom
R94  10k  [R0402_TI]  10.92,13.46 270 top
R95  8.25k/1%  [R0603_5MIL_DWS]  75.31,41.66 270 bottom
R96  3.32k/1%  [R0603_5MIL_DWS]  47.88,43.31 0 bottom
R97  1.1k/1%  [R0603_5MIL_DWS]  75.31,45.47 90 bottom
R98  4.99k/1%  [R0603_5MIL_DWS]  21.46,13.97 180 bottom
R99  4.99k/1%  [R0603_5MIL_DWS]  27.3,57.78 270 top
R100  100k/1%  [R0603_5MIL_DWS]  23.88,49.78 180 bottom
R101  10k  [R0402_TI]  24.51,13.21 90 bottom
R102  13k/1%  [R0603_5MIL_DWS]  24.51,9.91 270 bottom
R103  10k  [R0402_TI]  21.08,9.14 0 bottom
R104  1.1k/1%  [R0603_5MIL_DWS]  26.92,53.72 90 bottom
RECOVERY  SIDE_WTCM-TR(3X4)  [SW_TAKT3X4]  1.27,37.85 270 bottom
RESET  SIDE_WTCM-TR(3X4)  [SW_TAKT3X4]  1.27,46.1 270 bottom
RM1  RA1206_(4X0603)_4B8_4.7k  [R_MATRIX_4]  99.05,8.89 270 bottom
RM2  RA1206_(4X0603)_4B8_4.7k  [R_MATRIX_4]  94.15,7.09 270 bottom
RM3  RA1206_(4X0603)_4B8_51R  [R_MATRIX_4]  113.35,21.79 180 top
RM4  RA1206_(4X0603)_4B8_4.7k  [R_MATRIX_4]  49.78,2.16 180 bottom
RM5  RA1206_(4X0603)_4B8_100K  [R_MATRIX_4]  16.38,2.16 270 bottom
RSSI_LED  NA(LED/RED/0603)  [LED-0603]  165.75,50.59 180 top
RTC_BAT  BTH-V-20-LF  [3V_BAT_HOLDER]  77.75,18.49 270 top
SATA  SATA-PWA-07  [SATA-PWA-07]  3.98,42.91 90 top
SLEEP_LED  NA(LED/RED/0603)  [LED-0603]  165.75,53.09 180 top
T1  BC846B  [SOT23]  10.29,51.69 0 bottom
U1  A20  [TFBGA441]  38.65,28.29 180 top
U2  MEM4G16D3EABG-125  [FBGA96_MEM]  59.05,35.19 0 top
U3  MEM4G16D3EABG-125  [FBGA96_MEM]  59.05,24.29 0 top
U4  RTL8201CP  [LQFP48]  98.4,9.44 270 top
U5  AT24C16BN-SH  [SO-08MN]  79.12,12.06 270 bottom
U6  SY6280  [SOT23-5]  115.55,39.49 90 top
U7  WiFi_MODULE-RTL8188CUS  [PCB_WIFI]  146.9,8.36 180 top
U8  H27UBG8T2BTR  [TSOP48]  20.19,29.84 270 top
U9  GL850G-HHGXX  [SSOP28]  102.75,33.19 0 top
U10  PCF8563T/5  [SO-8]  90.05,34.49 0 top
U11  SY6280  [SOT23-5]  115.55,31.99 90 top
U12  NA(RCLAMP0524P)  [SLP2510P8]  12.06,22.35 90 top
U13  GL850G-HHGXX  [SSOP28]  126.65,33.19 0 top
U14  NA(RCLAMP0524P)  [SLP2510P8]  12.06,25.4 90 top
U15  NA(RCLAMP0524P)  [SLP2510P8]  12.06,28.32 90 top
U16  AXP209(QFN48)  [QFN48]  65.15,44.96 180 top
U17  MCP120T475I-TT  [SOT23']  76.85,46.19 0 top
U18  (XBEE/XBEE-PRO)+(HN1X20-2.0)+(2*PN1X10-2.0)???????  [XBEE&XBEE-PRO_RPSMA]  150.9,28.74 270 top
U19  SY8009AAAC(SOT23-5)  [SOT23-5]  51.82,41.91 90 bottom
U20  SY7208(SOT23-6)  [SOT23-6]  77.85,44.89 0 bottom
U21  SY6280  [SOT23-5]  21.46,11.56 180 bottom
U22  SY8009AAAC(SOT23-5)  [SOT23-5]  29.34,52.32 90 bottom
U23  FIDUCIAL  [FIDUCIAL-1X3]  10.25,55.19 180 top
U24  FIDUCIAL  [FIDUCIAL-1X3]  12.75,17.69 180 top
U25  FIDUCIAL  [FIDUCIAL-1X3]  17.75,58.69 0 bottom
U26  FIDUCIAL  [FIDUCIAL-1X3]  16.25,17.69 0 bottom
U27  FIDUCIAL  [FIDUCIAL-1X3]  164.25,17.69 0 top
U28  FIDUCIAL  [FIDUCIAL-1X3]  164.25,17.69 0 bottom
U$5  [LOGO-OPENHARDWARE_8X8]  124.58,37.7 0 bottom
U$6  [OLIMEX1_V]  77.75,23.69 0 bottom
U$9  [PB]  111.04,38.12 0 bottom
U$10  [ESD_SYMBOL]  120.3,34.11 0 bottom
U$11  [RECYCLE_BIN1/8]  108.03,34.92 0 bottom
U$12  [ROHS]  128.83,21.56 0 bottom
UART1  HN1X3  [HN1X3]  69.85,1.52 0 top
USB_HOST1  USB_A_VERTICAL  [USB_A_VERTICAL_PTH]  96.7,68.69 180 top
USB_HOST2  USB_A_VERTICAL  [USB_A_VERTICAL_PTH]  106.7,68.69 180 top
USB_HOST3  USB_A_VERTICAL  [USB_A_VERTICAL_PTH]  116.7,68.69 180 top
USB_HOST4  USB_A_VERTICAL  [USB_A_VERTICAL_PTH]  126.7,68.69 180 top
USB_HOST5  USB_A_VERTICAL  [USB_A_VERTICAL_PTH]  136.7,68.69 180 top
USB_HOST6  USB_A_VERTICAL  [USB_A_VERTICAL_PTH]  146.7,68.69 180 top
USB_HOST7  USB_A_VERTICAL  [USB_A_VERTICAL_PTH]  156.7,68.69 180 top
USB_OTG  USB-OTG  [USB_MINI_9PIN]  4.06,7.63 0 top
VR1  AP1231-2.5V(SOT23-5)  [SOT-23-5]  19.94,47.62 180 top
WIFI_VCC  1-2:Closed/2-3:Opened  [SJ_2_SMALL_12_TIED]  112.4,25.69 0 top
XBEE_RX  LED/YELLOW/0603  [LED-0603]  165.75,43.09 180 top
XBEE_TX  LED/GREEN/0603  [LED-0603]  165.75,45.59 180 top

## Tracks (layer width: path | path; a pad name or v marks a point on that pad's centre or on a via)
5VEXT  (via drill 0.5, 0.6)
  Top 0.203: U16.32 65.75,41 65.96,41 66.15,41 U16.33
  Top 0.406: R74.1 77.8,43.94 U17.2
  Top 0.61: v66.22,40.26 65.96,40.51 65.96,41 | 80.35,43.72 R80.1
  Top 0.8: U17.2 78.25,45.54 78.25,47.89 79.09,48.74 PWR_JACK.+
  Top 1.016: PWR_JACK.+ 81.8,43.72 | 81.8,43.72 C218.+ | 81.8,43.72 80.35,43.72
  Route3 1.016: PWR_JACK.+ 76.91,48.74 75.75,49.89 75.75,54.49 v77.47,56.22
  Route14 0.8: v77.47,56.22 66.17,56.22 65.55,55.59 v65.55,54.09
  Route14 0.813: v66.22,40.26 66.22,41.2
  Route14 1.016: 66.22,41.2 66.22,41.71 68.58,44.07 68.58,46.23 69.55,47.2 77.5,47.2 79.05,48.74 PWR_JACK.+
  Bottom 0.35: v65.55,54.09 65.55,52.99 65.79,52.76 5VEXT.1
  Bottom 0.406: 75.77,58.79 5V_E.1
  Bottom 0.61: D4.C 76.57,58.79 75.77,58.79
  Bottom 0.762: C176.2 66.22,39.57 v66.22,40.26
  Bottom 1.016: FET3.3 73.65,57.39 74.05,56.99 74.95,56.99 | 74.95,56.99 D5.A | 74.95,56.99 76.57,56.99 D4.C
  Bottom 1.523: v77.47,56.22 D4.C
#OVCUR1_1
  Top 0.35: 103.07,39.2 U9.21 | R36.1 103.07,39.2 | 103.07,39.2 R39.2
#OVCUR2_1
  Top 0.35: U13.21 126.97,39.2 | 126.97,39.2 R58.2 | 126.97,39.2 R55.1
+5V  (via drill 0.4, 0.5, 0.6)
  Top 0.25: U9.23 101.78,38.17 C126.1
  Top 0.35: U13.23 125.68,38.38 C153.1 123.34,39.2 C155.1
  Top 0.4: C126.1 C123.1 v98.25,39.2 | 116.5,36.69 C116.1 | 116.35,28.09 116.35,29.98 116.5,30.13 | v116.35,27.09 116.35,28.09 | 116.35,28.09 C146.1
  Top 0.5: v122.4,39.19 C155.1 | 116.5,30.13 U11.5 | 116.5,36.99 U6.5 | v117.45,36.99 116.5,36.99 | 116.5,36.99 116.5,36.69
  Top 0.508: v26.03,49.4 GPIO-1.1
  Top 0.61: 12.45,32.89 R59.2 R57.2 | v33.02,55.75 LCD_CON.1
  Top 0.762: v26.03,6.06 GPIO-2.1 | GPIO-3.1 33.02,1.82 32.45,2.39 v31.95,2.39
  Top 0.889: v69.47,51.44 70.63,52.59 73.06,52.59 FET4.2
  Top 1.016: 12.45,32.89 11.56,33.78 v11.56,34.67 v11.56,35.69
  Route3 1.016: v68.75,58.69 71.87,58.69 74.15,56.41 v74.15,53.39
  Route4 1.016: v68.75,58.69 69.15,58.29 69.15,54.29 69.47,53.97 v69.47,51.44
  Route13 1: 80.26,38.03 85.98,38.03 v87.16,39.2
  Route13 1.016: v11.56,34.67 v11.56,35.69 8.64,38.61 8.64,46.86 | 68.51,50.99 68.51,49.78 80.26,38.03 v80.26,25.85 | 33.02,52.7 v33.02,55.75 | 33.02,52.7 25.53,52.7 24,51.18 | 24,51.18 22.35,49.53 19.94,49.53 16.64,46.23 13.34,46.23 12.7,46.86 8.64,46.86 | 8.64,46.86 v8.64,57.53 | 33.02,52.7 57.6,52.7 59.32,50.99 67.01,50.99 | 67.01,50.99 68.45,50.99 | 67.01,50.99 68.51,50.99 | 68.51,50.99 68.67,50.99 69.11,51.44 v69.47,51.44 | v26.03,49.4 25.78,49.4 24,51.18
  Route14 0.508: v18.29,12.06 C236.1 v18.92,12.7
  Route14 1.016: v31.95,2.39 31.05,2.39 30.55,2.89 28.55,2.89 26.03,5.41 v26.03,6.06 26.03,8.25 22.48,11.81 19.18,11.81 | C236.1 19.18,11.81 | 19.18,11.81 16.52,11.81 11.56,16.77 v11.56,34.67 v11.56,35.69
  Bottom 0.254: v11.56,35.69 +5V.1
  Bottom 0.406: 74.75,58.79 5V_E.2
  Bottom 0.5: 108.95,33.79 R33.2 | 132.85,33.89 R51.2
  Bottom 0.508: 8,57.53 5V_E_SATA.1 | U21.5 20,12.51 19.56,12.06 C236.1 | C236.1 v18.29,12.06 | C236.1 v18.92,12.7 | v68.75,58.69 R72.2
  Bottom 0.61: FET1.2 9.78,55.73 R65.1 | FET3.2 71.1,58.34 71.55,58.79 74.75,58.79
  Bottom 0.762: 8,57.53 v8.64,57.53 9.34,56.83 FET1.2
  Bottom 1: 117.45,34.39 v117.45,36.99 | 108.95,34.39 105.75,34.39 100.94,39.2 v98.25,39.2 v87.16,39.2 | 132.85,33.89 132.85,34.39 131.45,35.79 122.6,35.79 | 117.45,34.39 121.2,34.39 122.6,35.79 | 122.6,35.79 122.6,37.44 122.4,37.64 v122.4,39.19 | 116.35,34.39 v116.35,27.09 | 108.95,34.39 108.95,33.79 | 108.95,34.39 116.35,34.39 | 116.35,34.39 117.45,34.39
  Bottom 1.016: v68.75,58.69 69.85,58.69 70.2,58.34 FET3.2 | v74.15,53.39 74.15,52.35 D5.K
  Bottom 1.524: FUSE1.1 v11.56,34.67 v11.56,35.69
+5V_OTG_PWR  (via drill 0.4, 0.6)
  Top 0.203: U16.31 65.35,41.3 65.1,41.05
  Top 0.508: v65.1,40.41 v65.1,41.02 65.1,41.05 | USB_OTG.VBUS 7.91,9.23 7.98,9.3 v10.03,9.3
  Route4 0.635: v65.1,40.41 65.1,40.91 65.28,41.08
  Route4 1.016: v81.15,50.69 79.75,50.69 76.68,47.62 69.98,47.62 68.58,46.23 68.58,44.39 65.28,41.08
  Route13 0.61: v65.1,40.41 v65.1,41.02 65.1,41.45 65.02,41.53 65.02,41.66 64.9,41.78
  Route13 1.016: 64.9,41.78 64.64,42.04 59.44,42.04 58.42,43.05 51.05,43.05 48.13,40.13 42.55,40.13 40.89,41.78 37.85,41.78 36.58,40.51 34.29,40.51 33.66,39.88 21.34,39.88 12.19,30.73 12.19,11.45 v10.03,9.3
  Bottom 0.508: C234.1 19.94,15.24 L21.1
  Bottom 0.61: v65.1,40.41 v65.1,41.02 65.15,41.02 | C234.1 17.15,13.46 13.34,13.46 10.03,10.16 v10.03,9.3
  Bottom 0.813: 65.15,41.02 C183.2
  Bottom 1.016: v81.15,50.69 R64.1
+24V  (via drill 0.4, 0.6)
  Top 0.203: U16.38 68.91,43.16 68.91,43.36 68.91,43.56 U16.39 | v70.1,44.45 69.85,44.45 69.54,44.76 U16.42
  Top 0.61: 68.91,43.36 v69.16,43.1 v69.16,42.48
  Top 1.016: LIPO_BAT.1 72.75,55.39 70.85,57.29 68.15,57.29 67.56,57.88 C228.2
  Route3 1.016: v72.55,48.89 72.55,53.19 72.75,53.39 LIPO_BAT.1
  PWR 0.508: v69.16,42.48 69.16,43.13
  Bottom 0.254: v69.16,42.48 70.29,42.48 BAT.1
  Bottom 0.61: v69.16,42.48 69.16,42.67
  Bottom 0.813: 69.16,42.67 v69.16,43.1 69.16,43.51 v70.1,44.45 70.39,44.73 72,44.73
  Bottom 1.016: R62.2 72,44.73 72.01,44.73 C177.2 C180.1 72.01,48.11 72.55,48.65 v72.55,48.89
ANT
  Top 0.254: U7.8 161,5.27
AVDD2  (via drill 0.5)
  Top 0.25: U9.10 104.38,27.67 C136.1 | C135.1 97.15,28.19 97.45,28.19 97.85,27.79 100.55,27.79
  Top 0.35: U9.5 101.12,28.37 100.55,27.79 | U9.1 98.53,30.39 97.95,30.39 97.4,30.94 95.9,30.94 C134.1
  Top 0.5: C134.1 93.17,28.97 93.17,29.4 94.35,30.58 94.35,31.79 94.73,32.18 L8.2 v97.15,32.18 | v96.75,29.52 C135.1 | v105.35,25.69 C136.1
  Bottom 0.5: v96.75,29.52 97.15,29.92 v97.15,32.18 98.87,32.18 v105.35,25.69
AVDD3  (via drill 0.5)
  Top 0.35: C165.1 121.65,27.69 124.45,27.69 125.03,28.27 U13.5 | U13.10 128.28,28.57 128.75,28.09 129.75,28.09 130.25,27.59 130.25,26.69
  Top 0.4: 122.43,30.79 U13.1
  Top 0.5: 122.43,30.79 122.22,30.99 120.05,30.99 118.65,29.59 118.35,29.59 118.05,29.29 118.05,28.94 C164.1 117.35,28.59 117.15,28.79 117.15,29.69 118.75,31.29 v118.75,31.69 118.88,31.82 119.79,31.82 L13.2 | v120.75,29.52 C165.1 | v129.62,26.69 130.25,26.69 C166.1
  Bottom 0.5: v120.75,29.52 120.75,30.79 119.85,31.69 v118.75,31.69 118.75,28.19 120.25,26.69 v129.62,26.69
BA0  (via drill 0.25)
  Top 0.127: v62.25,33.19 U2.M2 | U1.K3 v46.25,26.29 | v62.25,22.29 U3.M2
  Route3 0.127: v62.25,33.19 61.82,32.77 61.4,32.77 61.28,32.64 61.28,32.38 61.4,32.26 61.72,32.26 61.85,32.13 61.85,31.88 61.72,31.75 61.4,31.75 61.28,31.62 61.28,31.37 61.4,31.24 62.23,31.24 62.36,31.11 62.36,29.46 62.23,29.34 61.91,29.34 61.78,29.21 61.78,28.36 v62.25,27.89 61.85,27.49 61.85,24.89 61.98,24.77 62.55,24.77 62.67,24.64 62.67,24.51 62.55,24.38 61.98,24.38 61.85,24.26 61.85,24.13 61.98,24 62.55,24 62.67,23.88 62.67,23.75 62.55,23.62 61.98,23.62 61.85,23.5 61.85,22.69 v62.25,22.29